# Altium project B100AA.PrjPcb (part 4 of 7)

## Sheet Master MicroController Port D.SchDoc: Master Micro Controller Port D Pin Out
size A4; ApprovedBy: Mehmet Günce Akkoyun; CheckedBy: Mehmet Günce Akkoyun; Author: Mehmet Günce Akkoyun; CompanyName: Ovoo Electronics; DrawnBy: Mehmet Günce Akkoyun; Engineer: Mehmet Günce Akkoyun; Organization: Ovoo Electronics; Address1: Necip Fazıl Mah. Ortaırmak Sok.; Address2: Birgül Apt. No: 19/6; Address3: Meram / Konya; Address4: Turkiye; DocumentNumber: 19; Revision: R06; SheetNumber: 19; SheetTotal: 54
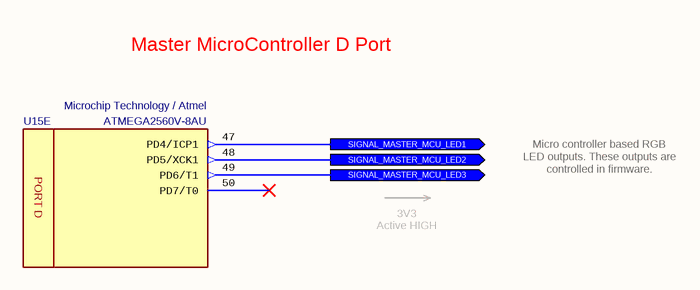
[diagram p31: Master MicroController Port D.SchDoc]

### Parts
U15  Manufacturer_Part_Number: ATMEGA2560V-8AU  Manufacturer_Name: Microchip Technology / Atmel  [TQFP100]  (hidden comment: 8-bit MicroController)  (part E of 15)

### Ports
SIGNAL_MASTER_MCU_LED1 (out), SIGNAL_MASTER_MCU_LED2 (out), SIGNAL_MASTER_MCU_LED3 (out)

### Nets
SIGNAL_MASTER_MCU_LED1: U15.47(PD4/ICP1) ; port SIGNAL_MASTER_MCU_LED1
SIGNAL_MASTER_MCU_LED2: U15.48(PD5/XCK1) ; port SIGNAL_MASTER_MCU_LED2
SIGNAL_MASTER_MCU_LED3: U15.49(PD6/T1) ; port SIGNAL_MASTER_MCU_LED3

Not connected (* = marked no-connect by the designer): U15 50(PD7/T0)*

### Notes on the sheet
- Master MicroController D Port
- 3V3
  Active HIGH
- Micro controller based RGB LED outputs. These outputs are controlled in firmware.
- Engineer
- All Rights are reserved to Customer and Engineer. [2021]
- Size:
- Date:
- A4
- Project :
- Time:
- Sheet
- of
- Customer
- Product ID
- Module ID
- Version
- File:
- Revision
- (in symbol IC - ATMEGA2560V-8AU, part E) PORT D

### Library data of the parts
U15 = IC - ATMEGA2560V-8AU: 8-bit Microcontrollers - MCU 256kB Flash 4kB EEPROM 86 I/O Pins; Supply Voltage - Min: 2V7; Supply Voltage - Max: 5.5V; Height: 1mm; Mouser_Part_Number: 556-ATMEGA2560V8AU; ComponentLink1Description: DataSheet; ComponentLink1URL: https://eu.mouser.com/datasheet/2/268/Atmel-2549-8-bit-AVR-Microcontroller-ATmega640-128-1315286.pdf; ROHS: Yes; Minimum Operating Temperature: -40; Maximum Operating Temperature: +85; ComponentLink2Description: Mouser; ComponentLink2URL: https://eu.mouser.com/ProductDetail/Microchip-Technology-Atmel/ATMEGA2560V-8AU?qs=sGAEpiMZZMutXGli8Ay4kKlCYcvZUWqJYdtgGFyqFT8%3D; Supplier 1: Mouser; Supplier 2: Arrow; Supplier 3: Farnell; Supplier 4: Newark; Supplier 5: Digi-Key; Supplier Part Number 1: 556-ATMEGA2560V8AU; Supplier Part Number 2: ATMEGA2560V-8AU; Supplier Part Number 3: 1288331; Supplier Part Number 4: 68T2784; Supplier Part Number 5: ATMEGA2560V-8AU-ND; Case: TQFP-100

## Sheet Master MicroController Serial Communication Port.SchDoc: Master MicroController Communication Port Pin Out
size A4; ApprovedBy: Mehmet Günce Akkoyun; CheckedBy: Mehmet Günce Akkoyun; Author: Mehmet Günce Akkoyun; CompanyName: Ovoo Electronics; DrawnBy: Mehmet Günce Akkoyun; Engineer: Mehmet Günce Akkoyun; Organization: Ovoo Electronics; Address1: Necip Fazıl Mah. Ortaırmak Sok.; Address2: Birgül Apt. No: 19/6; Address3: Meram / Konya; Address4: Turkiye; DocumentNumber: 27; Revision: R06; SheetNumber: 27; SheetTotal: 54
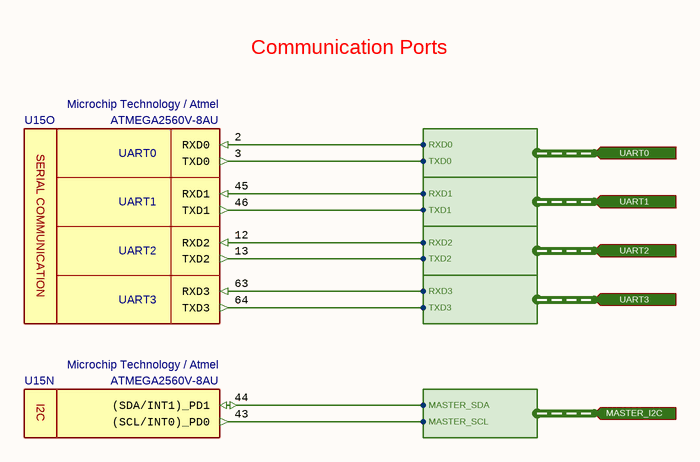
[diagram p32: Master MicroController Serial Communication Port.SchDoc]

### Parts
U15  Manufacturer_Part_Number: ATMEGA2560V-8AU  Manufacturer_Name: Microchip Technology / Atmel  [TQFP100]  (hidden comment: 8-bit MicroController)  (parts N,O of 15)

### Ports
MASTER_I2C (in, harness MASTER_I2C), UART0 (in, harness UART0), UART1 (in, harness UART1), UART2 (in, harness UART2), UART3 (in, harness UART3)

### Harnesses
UART0: RXD0, TXD0
UART1: RXD1, TXD1
UART2: RXD2, TXD2
UART3: RXD3, TXD3
MASTER_I2C: MASTER_SDA, MASTER_SCL

### Nets
GSM_3V3_UART.GSM_3V3_RX: U15.64(TXD3) ; port UART3.TXD3
GSM_3V3_UART.GSM_3V3_TX: U15.63(RXD3) ; port UART3.RXD3
MASTER_I2C.MASTER_SCL: U15.43((SCL/INT0)_PD0) ; port MASTER_I2C.MASTER_SCL
MASTER_I2C.MASTER_SDA: U15.44((SDA/INT1)_PD1) ; port MASTER_I2C.MASTER_SDA
UART0.RXD0: U15.2(RXD0) ; port UART0.RXD0
UART0.TXD0: U15.3(TXD0) ; port UART0.TXD0
UART1.RXD1: U15.45(RXD1) ; port UART1.RXD1
UART1.TXD1: U15.46(TXD1) ; port UART1.TXD1
UART2.RXD2: U15.12(RXD2) ; port UART2.RXD2
UART2.TXD2: U15.13(TXD2) ; port UART2.TXD2

### Notes on the sheet
- Communication Ports
- Engineer
- All Rights are reserved to Customer and Engineer. [2021]
- Size:
- Date:
- A4
- Project :
- Time:
- Sheet
- of
- Customer
- Product ID
- Module ID
- Version
- File:
- Revision
- (in symbol IC - ATMEGA2560V-8AU, part N) I2C
- (in symbol IC - ATMEGA2560V-8AU, part O) UART0; UART1; SERIAL COMMUNICATION; UART2; UART3

### Library data of the parts
U15 = IC - ATMEGA2560V-8AU: as U15 on sheet Master MicroController Port D; Height: 1mm; Mouser_Part_Number: 556-ATMEGA2560V8AU; ComponentLink1Description: DataSheet; ComponentLink1URL: https://eu.mouser.com/datasheet/2/268/Atmel-2549-8-bit-AVR-Microcontroller-ATmega640-128-1315286.pdf; ROHS: Yes; Minimum Operating Temperature: -40; Maximum Operating Temperature: +85; ComponentLink2Description: Mouser; ComponentLink2URL: https://eu.mouser.com/ProductDetail/Microchip-Technology-Atmel/ATMEGA2560V-8AU?qs=sGAEpiMZZMutXGli8Ay4kKlCYcvZUWqJYdtgGFyqFT8%3D; Supplier 1: Mouser; Supplier 2: Arrow; Supplier 3: Farnell; Supplier 4: Newark; Supplier 5: Digi-Key; Supplier Part Number 1: 556-ATMEGA2560V8AU; Supplier Part Number 2: ATMEGA2560V-8AU; Supplier Part Number 3: 1288331; Supplier Part Number 4: 68T2784; Supplier Part Number 5: ATMEGA2560V-8AU-ND; Case: TQFP-100

## Sheet Module Output Sockets.SchDoc: Module Output Sockets
size A2; ApprovedBy: Mehmet Günce Akkoyun; CheckedBy: Mehmet Günce Akkoyun; Author: Mehmet Günce Akkoyun; CompanyName: Ovoo Electronics; DrawnBy: Mehmet Günce Akkoyun; Engineer: Mehmet Günce Akkoyun; Organization: Ovoo Electronics; Address1: Necip Fazıl Mah. Ortaırmak Sok.; Address2: Birgül Apt. No: 19/6; Address3: Meram / Konya; Address4: Turkiye; DocumentNumber: 29; Revision: R06; SheetNumber: 29; SheetTotal: 54
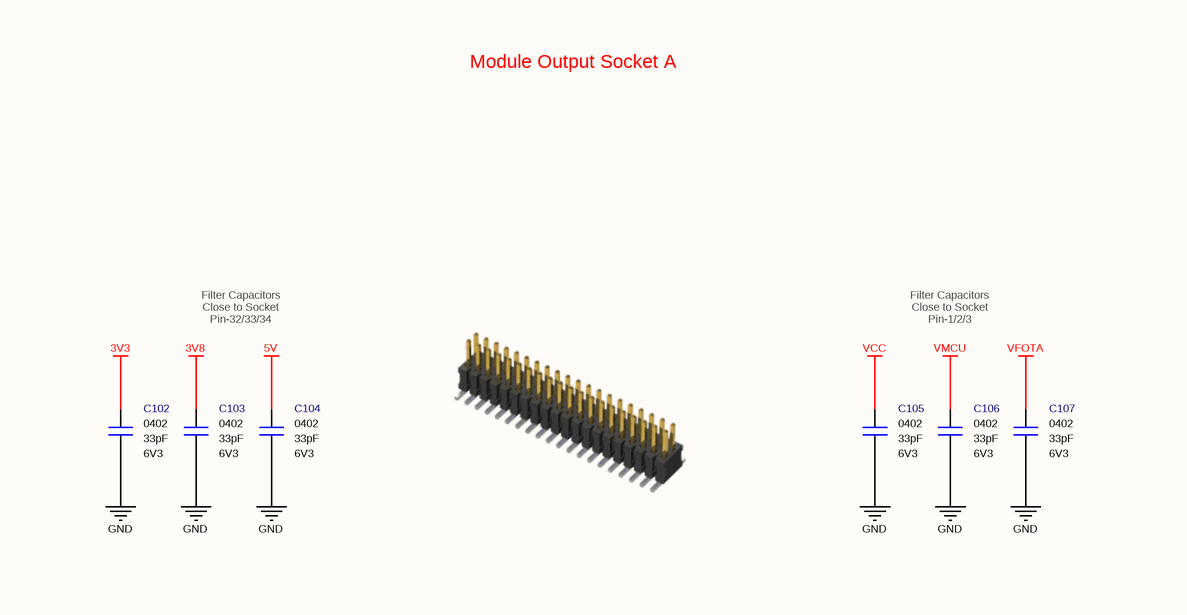
[diagram p33: Module Output Sockets.SchDoc, top left]
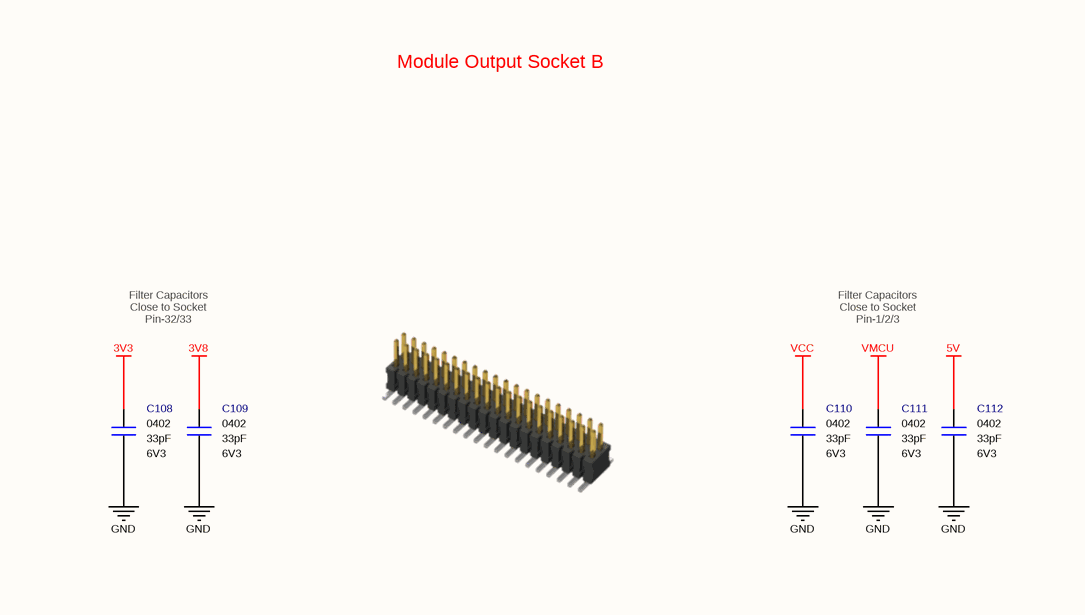
[diagram p34: Module Output Sockets.SchDoc, top right]
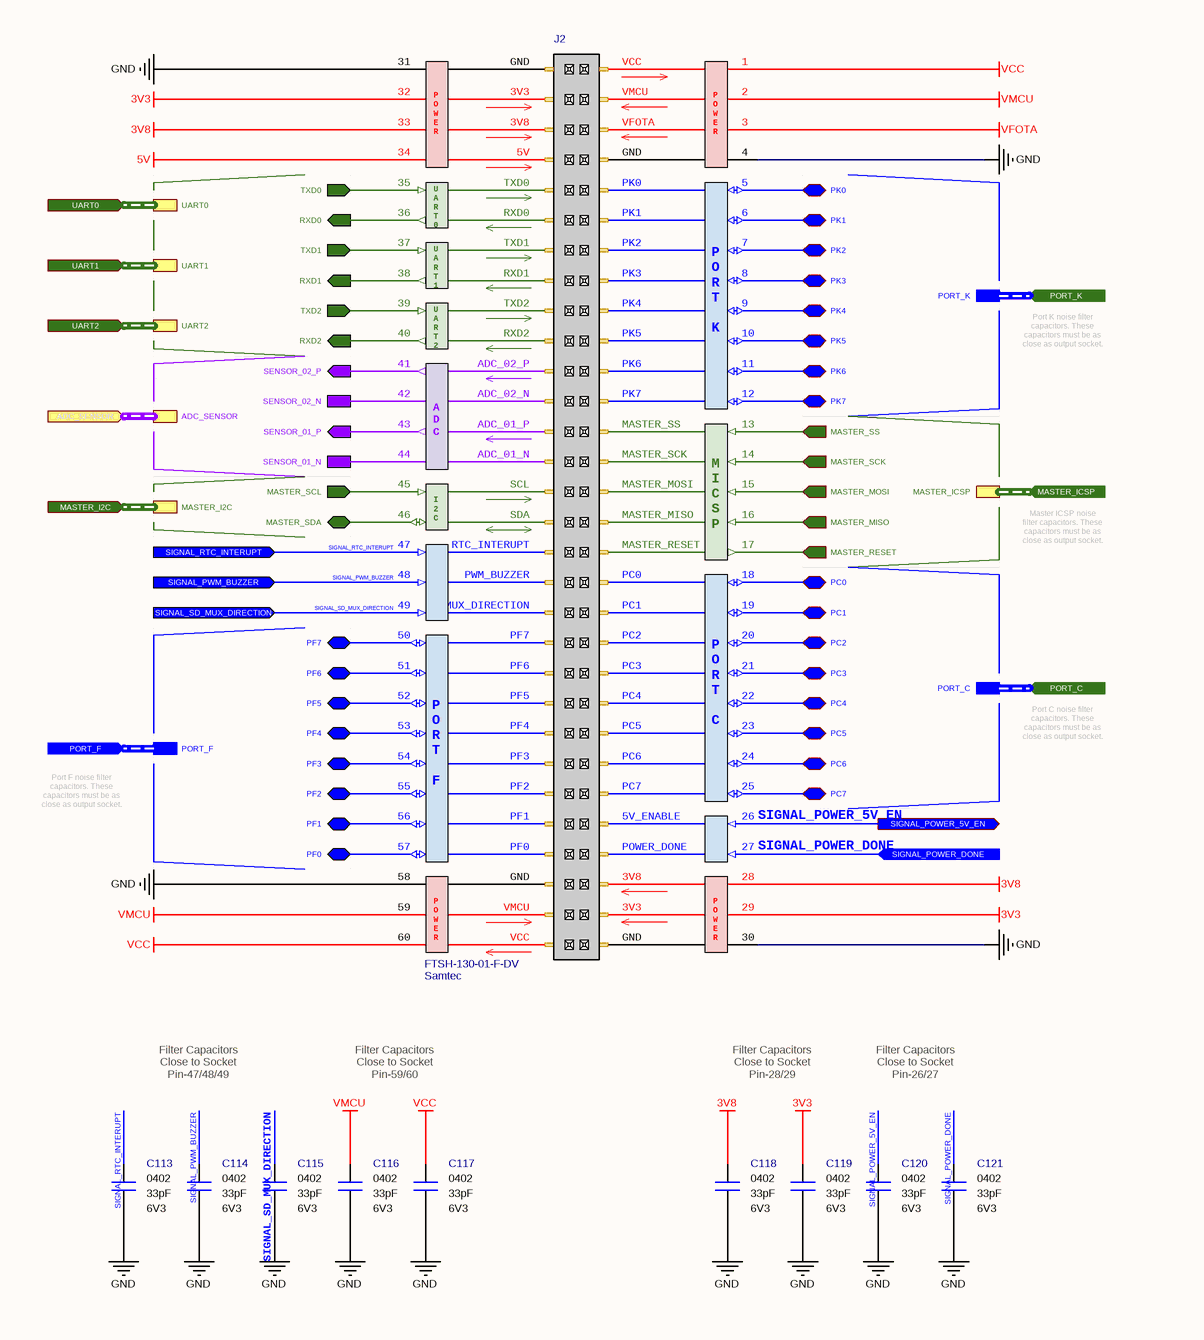
[diagram p35: Module Output Sockets.SchDoc, bottom left]
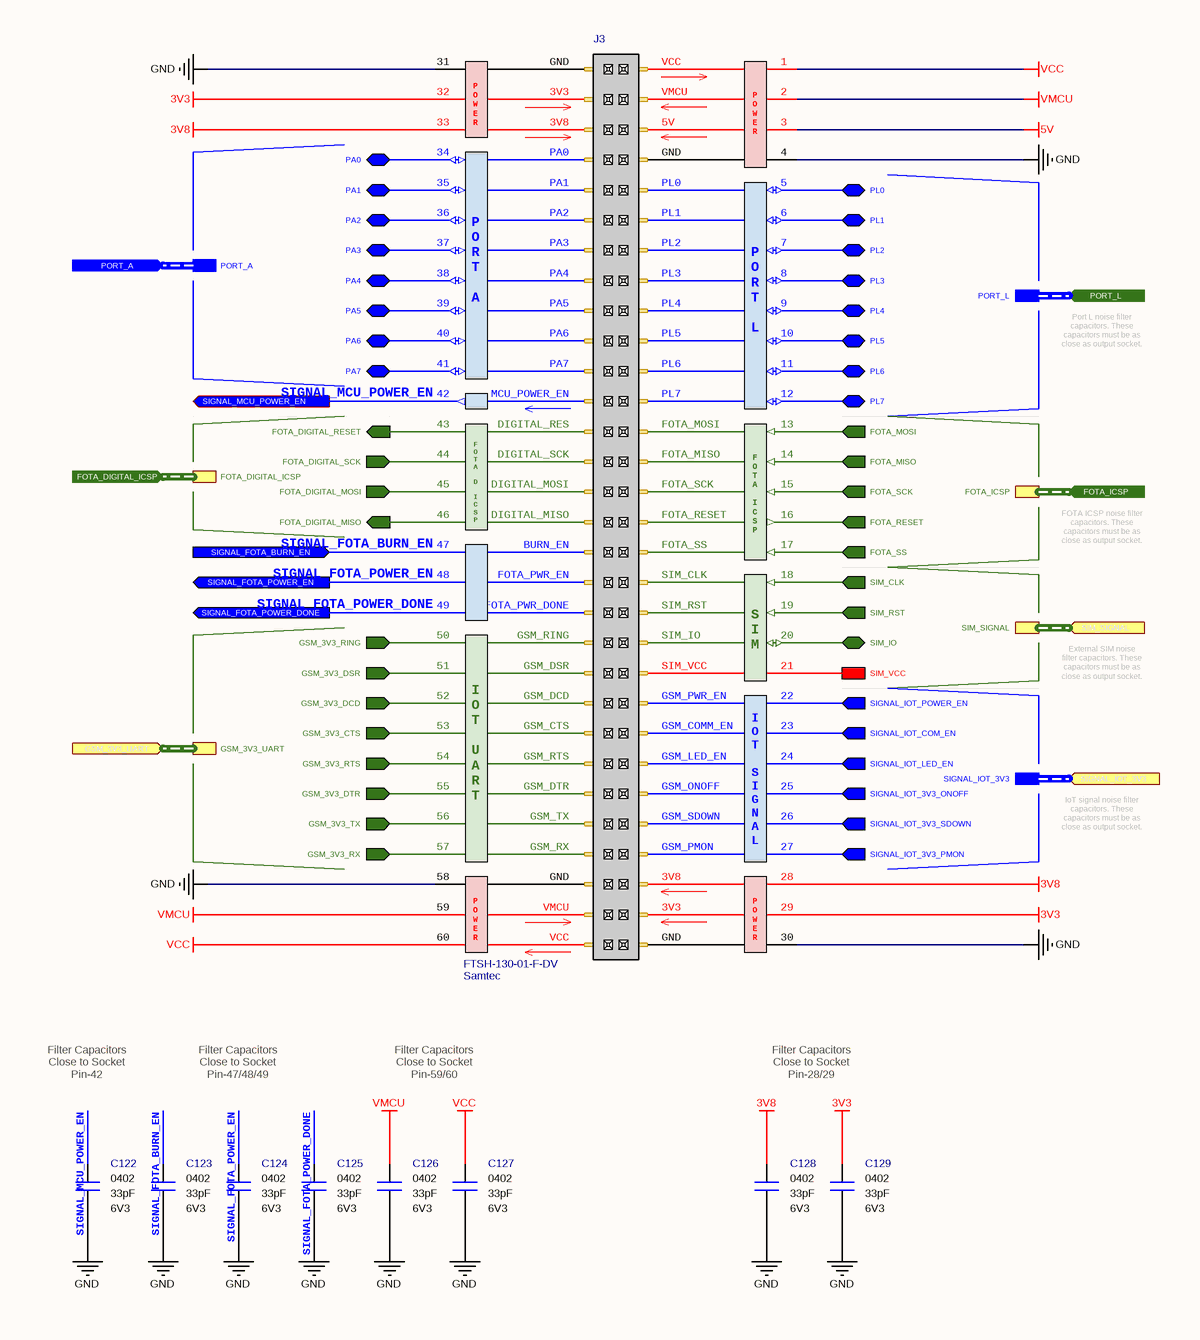
[diagram p36: Module Output Sockets.SchDoc, bottom right]

### Parts
C102  value 33pF  Case: 0402  Voltage: 6V3  [CAPACITOR_0402]  (hidden comment: Multilayer Ceramic Capacitor)
C103  value 33pF  Case: 0402  Voltage: 6V3  [CAPACITOR_0402]  (hidden comment: Multilayer Ceramic Capacitor)
C104  value 33pF  Case: 0402  Voltage: 6V3  [CAPACITOR_0402]  (hidden comment: Multilayer Ceramic Capacitor)
C105  value 33pF  Case: 0402  Voltage: 6V3  [CAPACITOR_0402]  (hidden comment: Multilayer Ceramic Capacitor)
C106  value 33pF  Case: 0402  Voltage: 6V3  [CAPACITOR_0402]  (hidden comment: Multilayer Ceramic Capacitor)
C107  value 33pF  Case: 0402  Voltage: 6V3  [CAPACITOR_0402]  (hidden comment: Multilayer Ceramic Capacitor)
C108  value 33pF  Case: 0402  Voltage: 6V3  [CAPACITOR_0402]  (hidden comment: Multilayer Ceramic Capacitor)
C109  value 33pF  Case: 0402  Voltage: 6V3  [CAPACITOR_0402]  (hidden comment: Multilayer Ceramic Capacitor)
C110  value 33pF  Case: 0402  Voltage: 6V3  [CAPACITOR_0402]  (hidden comment: Multilayer Ceramic Capacitor)
C111  value 33pF  Case: 0402  Voltage: 6V3  [CAPACITOR_0402]  (hidden comment: Multilayer Ceramic Capacitor)
C112  value 33pF  Case: 0402  Voltage: 6V3  [CAPACITOR_0402]  (hidden comment: Multilayer Ceramic Capacitor)
C113  value 33pF  Case: 0402  Voltage: 6V3  [CAPACITOR_0402]  (hidden comment: Multilayer Ceramic Capacitor)
C114  value 33pF  Case: 0402  Voltage: 6V3  [CAPACITOR_0402]  (hidden comment: Multilayer Ceramic Capacitor)
C115  value 33pF  Case: 0402  Voltage: 6V3  [CAPACITOR_0402]  (hidden comment: Multilayer Ceramic Capacitor)
C116  value 33pF  Case: 0402  Voltage: 6V3  [CAPACITOR_0402]  (hidden comment: Multilayer Ceramic Capacitor)
C117  value 33pF  Case: 0402  Voltage: 6V3  [CAPACITOR_0402]  (hidden comment: Multilayer Ceramic Capacitor)
C118  value 33pF  Case: 0402  Voltage: 6V3  [CAPACITOR_0402]  (hidden comment: Multilayer Ceramic Capacitor)
C119  value 33pF  Case: 0402  Voltage: 6V3  [CAPACITOR_0402]  (hidden comment: Multilayer Ceramic Capacitor)
C120  value 33pF  Case: 0402  Voltage: 6V3  [CAPACITOR_0402]  (hidden comment: Multilayer Ceramic Capacitor)
C121  value 33pF  Case: 0402  Voltage: 6V3  [CAPACITOR_0402]  (hidden comment: Multilayer Ceramic Capacitor)
C122  value 33pF  Case: 0402  Voltage: 6V3  [CAPACITOR_0402]  (hidden comment: Multilayer Ceramic Capacitor)
C123  value 33pF  Case: 0402  Voltage: 6V3  [CAPACITOR_0402]  (hidden comment: Multilayer Ceramic Capacitor)
C124  value 33pF  Case: 0402  Voltage: 6V3  [CAPACITOR_0402]  (hidden comment: Multilayer Ceramic Capacitor)
C125  value 33pF  Case: 0402  Voltage: 6V3  [CAPACITOR_0402]  (hidden comment: Multilayer Ceramic Capacitor)
C126  value 33pF  Case: 0402  Voltage: 6V3  [CAPACITOR_0402]  (hidden comment: Multilayer Ceramic Capacitor)
C127  value 33pF  Case: 0402  Voltage: 6V3  [CAPACITOR_0402]  (hidden comment: Multilayer Ceramic Capacitor)
C128  value 33pF  Case: 0402  Voltage: 6V3  [CAPACITOR_0402]  (hidden comment: Multilayer Ceramic Capacitor)
C129  value 33pF  Case: 0402  Voltage: 6V3  [CAPACITOR_0402]  (hidden comment: Multilayer Ceramic Capacitor)
J2  Manufacturer Part Number: FTSH-130-01-F-DV  Manufacturer Name: Samtec  [SAMTEC-FTSH-130-01-X-DV]  (hidden comment: 1.27 mm Pitch 2x30P Male Connector)
J3  Manufacturer Part Number: FTSH-130-01-F-DV  Manufacturer Name: Samtec  [SAMTEC-FTSH-130-01-X-DV]  (hidden comment: 1.27 mm Pitch 2x30P Male Connector)

### Sub-sheets
ADC Sensor Filter Capacitors = Filter Capacitors - ADC Sensor.SchDoc: ADC_SENSOR (harness ADC_SENSOR), SENSOR_01_N, SENSOR_01_P (in), SENSOR_02_N, SENSOR_02_P (in)
FOTA Digital ICSP Filter Capacitors = Filter Capacitors - FOTA Digital ICSP.SchDoc: FOTA_DIGITAL_ICSP (harness FOTA_DIGITAL_ICSP), FOTA_DIGITAL_MISO (in), FOTA_DIGITAL_MOSI (out), FOTA_DIGITAL_SCK (out), FOTA_DIGITAL_RESET (in)
FOTA ICSP Filter Capacitors = Filter Capacitors - FOTA ICSP.SchDoc: FOTA_ICSP (harness FOTA_ICSP), FOTA_MOSI (out), FOTA_SS (out), FOTA_MISO (out), FOTA_SCK (out), FOTA_RESET (out)
I2C Filter Capacitors = Filter Capacitors - I2C.SchDoc: MASTER_I2C (harness MASTER_I2C), MASTER_SDA (bidir), MASTER_SCL (out)
IoT UART Filter Capacitors = Filter Capacitors - IoT UART.SchDoc: GSM_3V3_UART (harness GSM_3V3_UART), GSM_3V3_RTS (out), GSM_3V3_RING (out), GSM_3V3_CTS (out), GSM_3V3_DTR (out), GSM_3V3_DCD (out), GSM_3V3_RX (out), GSM_3V3_DSR (out), GSM_3V3_TX (out)
Master ICSP Filter Capacitors = Filter Capacitors - Master ICSP.SchDoc: MASTER_ICSP (harness MASTER_ICSP), MASTER_SS (out), MASTER_RESET (out), MASTER_SCK (out), MASTER_MOSI (out), MASTER_MISO (out)
PORT A Filter Capacitors = Filter Capacitors - Port A.SchDoc: PA4 (bidir), PA2 (bidir), PA0 (bidir), PA5 (bidir), PA3 (bidir), PA1 (bidir), PA7 (bidir), PA6 (bidir), PORT_A (harness PORT_A)
PORT C Filter Capacitors = Filter Capacitors - Port C.SchDoc: PC4 (bidir), PC2 (bidir), PC0 (bidir), PC5 (bidir), PC3 (bidir), PC1 (bidir), PC7 (bidir), PC6 (bidir), PORT_C (harness PORT_C)
PORT F Filter Capacitors = Filter Capacitors - Port F.SchDoc: PF4 (bidir), PF2 (bidir), PF0 (bidir), PF5 (bidir), PF3 (bidir), PF1 (bidir), PF7 (bidir), PF6 (bidir), PORT_F (harness PORT_F)
PORT K Filter Capacitors = Filter Capacitors - Port K.SchDoc: PK4 (bidir), PK2 (bidir), PK0 (bidir), PK5 (bidir), PK3 (bidir), PK1 (bidir), PK7 (bidir), PK6 (bidir), PORT_K (harness PORT_K)
PORT L Filter Capacitors = Filter Capacitors - Port L.SchDoc: PL4 (bidir), PL2 (bidir), PL0 (bidir), PL5 (bidir), PL3 (bidir), PL1 (bidir), PL7 (bidir), PL6 (bidir), PORT_L (harness PORT_L)
Serial Communication Filter Capacitors = Filter Capacitors - Serial Communication.SchDoc: UART0 (harness UART0), TXD2 (out), UART2 (harness UART2), TXD1 (out), RXD1 (in), RXD0 (in), TXD0 (out), UART1 (harness UART1), RXD2 (in)
Signal IoT Filter Capacitors = Filter Capacitors - Signal IoT.SchDoc: SIGNAL_IOT_3V3_SDOWN (out), SIGNAL_IOT_LED_EN (out), SIGNAL_IOT_POWER_EN (out), SIGNAL_IOT_3V3_PMON (out), SIGNAL_IOT_3V3_ONOFF (out), SIGNAL_IOT_COM_EN (out), SIGNAL_IOT_3V3 (harness SIGNAL_IOT_3V3)
SIM Signal Filter Capacitors = Filter Capacitors - External SIM.SchDoc: SIM_SIGNAL (harness SIM_SIGNAL), SIM_CLK (out), SIM_RST (out), SIM_IO (bidir), SIM_VCC

### Ports
ADC_SENSOR (in, harness ADC_SENSOR), FOTA_DIGITAL_ICSP (in, harness FOTA_DIGITAL_ICSP), FOTA_ICSP (in, harness FOTA_ICSP), GSM_3V3_UART (in, harness GSM_3V3_UART), MASTER_I2C (in, harness MASTER_I2C), MASTER_ICSP (in, harness MASTER_ICSP), PORT_A (in, harness PORT_A), PORT_C (in, harness PORT_C), PORT_F (in, harness PORT_F), PORT_K (in, harness PORT_K), PORT_L (in, harness PORT_L), SIGNAL_FOTA_BURN_EN (in), SIGNAL_FOTA_POWER_DONE (out), SIGNAL_FOTA_POWER_EN (out), SIGNAL_IOT_3V3 (in, harness SIGNAL_IOT_3V3), SIGNAL_MCU_POWER_EN (out), SIGNAL_POWER_5V_EN (out), SIGNAL_POWER_DONE (in), SIGNAL_PWM_BUZZER (in), SIGNAL_RTC_INTERUPT (in), SIGNAL_SD_MUX_DIRECTION (in), SIM_SIGNAL (in, harness SIM_SIGNAL), UART0 (in, harness UART0), UART1 (in, harness UART1), UART2 (in, harness UART2)

### Nets
3V3: C102.2 C108.2 C119.2 C129.2 J2.29(Pin-29) J2.32(Pin-32) J3.29(Pin-29) J3.32(Pin-32)
3V8: C103.2 C109.2 C118.2 C128.2 J2.28(Pin-28) J2.33(Pin-33) J3.28(Pin-28) J3.33(Pin-33)
5V: C104.2 C112.2 J2.34(Pin-34) J3.3(Pin-3)
GND: C102.1 C103.1 C104.1 C105.1 C106.1 C107.1 C108.1 C109.1 C110.1 C111.1 C112.1 C113.1 C114.1 C115.1 C116.1 C117.1 C118.1 C119.1 C120.1 C121.1 C122.1 C123.1 C124.1 C125.1 C126.1 C127.1 C128.1 C129.1 J2.4(Pin-4) J2.30(Pin-30) J2.31(Pin-31) J2.58(Pin-58) J3.4(Pin-4) J3.30(Pin-30) J3.31(Pin-31) J3.58(Pin-58)
VCC: C105.2 C110.2 C117.2 C127.2 J2.1(Pin-1) J2.60(Pin-60) J3.1(Pin-1) J3.60(Pin-60)
VFOTA: C107.2 J2.3(Pin-3)
VMCU: C106.2 C111.2 C116.2 C126.2 J2.2(Pin-2) J2.59(Pin-59) J3.2(Pin-2) J3.59(Pin-59)
FOTA_DIGITAL_ICSP.FOTA_DIGITAL_MISO: J3.46(Pin-46) ; sheet FOTA Digital ICSP Filter Capacitors/FOTA_DIGITAL_MISO
FOTA_DIGITAL_ICSP.FOTA_DIGITAL_MOSI: J3.45(Pin-45) ; sheet FOTA Digital ICSP Filter Capacitors/FOTA_DIGITAL_MOSI
FOTA_DIGITAL_ICSP.FOTA_DIGITAL_RESET: J3.43(Pin-43) ; sheet FOTA Digital ICSP Filter Capacitors/FOTA_DIGITAL_RESET
FOTA_DIGITAL_ICSP.FOTA_DIGITAL_SCK: J3.44(Pin-44) ; sheet FOTA Digital ICSP Filter Capacitors/FOTA_DIGITAL_SCK
FOTA_ICSP.FOTA_MISO: J3.14(Pin-14) ; sheet FOTA ICSP Filter Capacitors/FOTA_MISO
FOTA_ICSP.FOTA_MOSI: J3.13(Pin-13) ; sheet FOTA ICSP Filter Capacitors/FOTA_MOSI
FOTA_ICSP.FOTA_RESET: J3.16(Pin-16) ; sheet FOTA ICSP Filter Capacitors/FOTA_RESET
FOTA_ICSP.FOTA_SCK: J3.15(Pin-15) ; sheet FOTA ICSP Filter Capacitors/FOTA_SCK
FOTA_ICSP.FOTA_SS: J3.17(Pin-17) ; sheet FOTA ICSP Filter Capacitors/FOTA_SS
GSM_3V3_UART.GSM_3V3_CTS: J3.53(Pin-53) ; sheet IoT UART Filter Capacitors/GSM_3V3_CTS
GSM_3V3_UART.GSM_3V3_DCD: J3.52(Pin-52) ; sheet IoT UART Filter Capacitors/GSM_3V3_DCD
GSM_3V3_UART.GSM_3V3_DSR: J3.51(Pin-51) ; sheet IoT UART Filter Capacitors/GSM_3V3_DSR
GSM_3V3_UART.GSM_3V3_DTR: J3.55(Pin-55) ; sheet IoT UART Filter Capacitors/GSM_3V3_DTR
GSM_3V3_UART.GSM_3V3_RING: J3.50(Pin-50) ; sheet IoT UART Filter Capacitors/GSM_3V3_RING
GSM_3V3_UART.GSM_3V3_RTS: J3.54(Pin-54) ; sheet IoT UART Filter Capacitors/GSM_3V3_RTS
GSM_3V3_UART.GSM_3V3_RX: J3.57(Pin-57) ; sheet IoT UART Filter Capacitors/GSM_3V3_RX
GSM_3V3_UART.GSM_3V3_TX: J3.56(Pin-56) ; sheet IoT UART Filter Capacitors/GSM_3V3_TX
MASTER_I2C.MASTER_SCL: J2.45(Pin-45) ; sheet I2C Filter Capacitors/MASTER_SCL
MASTER_I2C.MASTER_SDA: J2.46(Pin-46) ; sheet I2C Filter Capacitors/MASTER_SDA
MASTER_ICSP.MASTER_MISO: J2.16(Pin-16) ; sheet Master ICSP Filter Capacitors/MASTER_MISO
MASTER_ICSP.MASTER_MOSI: J2.15(Pin-15) ; sheet Master ICSP Filter Capacitors/MASTER_MOSI
MASTER_ICSP.MASTER_RESET: J2.17(Pin-17) ; sheet Master ICSP Filter Capacitors/MASTER_RESET
MASTER_ICSP.MASTER_SCK: J2.14(Pin-14) ; sheet Master ICSP Filter Capacitors/MASTER_SCK
MASTER_ICSP.MASTER_SS: J2.13(Pin-13) ; sheet Master ICSP Filter Capacitors/MASTER_SS
PORT_A.PA0: J3.34(Pin-34) ; sheet PORT A Filter Capacitors/PA0
PORT_A.PA1: J3.35(Pin-35) ; sheet PORT A Filter Capacitors/PA1
PORT_A.PA2: J3.36(Pin-36) ; sheet PORT A Filter Capacitors/PA2
PORT_A.PA3: J3.37(Pin-37) ; sheet PORT A Filter Capacitors/PA3
PORT_A.PA4: J3.38(Pin-38) ; sheet PORT A Filter Capacitors/PA4
PORT_A.PA5: J3.39(Pin-39) ; sheet PORT A Filter Capacitors/PA5
PORT_A.PA6: J3.40(Pin-40) ; sheet PORT A Filter Capacitors/PA6
PORT_A.PA7: J3.41(Pin-41) ; sheet PORT A Filter Capacitors/PA7
PORT_C.PC0: J2.18(Pin-18) ; sheet PORT C Filter Capacitors/PC0
PORT_C.PC1: J2.19(Pin-19) ; sheet PORT C Filter Capacitors/PC1
PORT_C.PC2: J2.20(Pin-20) ; sheet PORT C Filter Capacitors/PC2
PORT_C.PC3: J2.21(Pin-21) ; sheet PORT C Filter Capacitors/PC3
PORT_C.PC4: J2.22(Pin-22) ; sheet PORT C Filter Capacitors/PC4
PORT_C.PC5: J2.23(Pin-23) ; sheet PORT C Filter Capacitors/PC5
PORT_C.PC6: J2.24(Pin-24) ; sheet PORT C Filter Capacitors/PC6
PORT_C.PC7: J2.25(Pin-25) ; sheet PORT C Filter Capacitors/PC7
PORT_F.PF0: J2.57(Pin-57) ; sheet PORT F Filter Capacitors/PF0
PORT_F.PF1: J2.56(Pin-56) ; sheet PORT F Filter Capacitors/PF1
PORT_F.PF2: J2.55(Pin-55) ; sheet PORT F Filter Capacitors/PF2
PORT_F.PF3: J2.54(Pin-54) ; sheet PORT F Filter Capacitors/PF3
PORT_F.PF4: J2.53(Pin-53) ; sheet PORT F Filter Capacitors/PF4
PORT_F.PF5: J2.52(Pin-52) ; sheet PORT F Filter Capacitors/PF5
PORT_F.PF6: J2.51(Pin-51) ; sheet PORT F Filter Capacitors/PF6
PORT_F.PF7: J2.50(Pin-50) ; sheet PORT F Filter Capacitors/PF7
PORT_K.PK0: J2.5(Pin-5) ; sheet PORT K Filter Capacitors/PK0
PORT_K.PK1: J2.6(Pin-6) ; sheet PORT K Filter Capacitors/PK1
PORT_K.PK2: J2.7(Pin-7) ; sheet PORT K Filter Capacitors/PK2
PORT_K.PK3: J2.8(Pin-8) ; sheet PORT K Filter Capacitors/PK3
PORT_K.PK4: J2.9(Pin-9) ; sheet PORT K Filter Capacitors/PK4
PORT_K.PK5: J2.10(Pin-10) ; sheet PORT K Filter Capacitors/PK5
PORT_K.PK6: J2.11(Pin-11) ; sheet PORT K Filter Capacitors/PK6
PORT_K.PK7: J2.12(Pin-12) ; sheet PORT K Filter Capacitors/PK7
PORT_L.PL0: J3.5(Pin-5) ; sheet PORT L Filter Capacitors/PL0
PORT_L.PL1: J3.6(Pin-6) ; sheet PORT L Filter Capacitors/PL1
PORT_L.PL2: J3.7(Pin-7) ; sheet PORT L Filter Capacitors/PL2
PORT_L.PL3: J3.8(Pin-8) ; sheet PORT L Filter Capacitors/PL3
PORT_L.PL4: J3.9(Pin-9) ; sheet PORT L Filter Capacitors/PL4
PORT_L.PL5: J3.10(Pin-10) ; sheet PORT L Filter Capacitors/PL5
PORT_L.PL6: J3.11(Pin-11) ; sheet PORT L Filter Capacitors/PL6
PORT_L.PL7: J3.12(Pin-12) ; sheet PORT L Filter Capacitors/PL7
SIGNAL_FOTA_BURN_EN: C123.2 J3.47(Pin-47) ; port SIGNAL_FOTA_BURN_EN
SIGNAL_FOTA_POWER_DONE: C125.2 J3.49(Pin-49) ; port SIGNAL_FOTA_POWER_DONE
SIGNAL_FOTA_POWER_EN: C124.2 J3.48(Pin-48) ; port SIGNAL_FOTA_POWER_EN
SIGNAL_IOT_3V3.SIGNAL_IOT_3V3_ONOFF: J3.25(Pin-25) ; sheet Signal IoT Filter Capacitors/SIGNAL_IOT_3V3_ONOFF
SIGNAL_IOT_3V3.SIGNAL_IOT_3V3_PMON: J3.27(Pin-27) ; sheet Signal IoT Filter Capacitors/SIGNAL_IOT_3V3_PMON
SIGNAL_IOT_3V3.SIGNAL_IOT_3V3_SDOWN: J3.26(Pin-26) ; sheet Signal IoT Filter Capacitors/SIGNAL_IOT_3V3_SDOWN
SIGNAL_IOT_3V3.SIGNAL_IOT_COM_EN: J3.23(Pin-23) ; sheet Signal IoT Filter Capacitors/SIGNAL_IOT_COM_EN
SIGNAL_IOT_3V3.SIGNAL_IOT_LED_EN: J3.24(Pin-24) ; sheet Signal IoT Filter Capacitors/SIGNAL_IOT_LED_EN
SIGNAL_IOT_3V3.SIGNAL_IOT_POWER_EN: J3.22(Pin-22) ; sheet Signal IoT Filter Capacitors/SIGNAL_IOT_POWER_EN
SIGNAL_MCU_POWER_EN: C122.2 J3.42(Pin-42) ; port SIGNAL_MCU_POWER_EN
SIGNAL_POWER_5V_EN: C120.2 J2.26(Pin-26) ; port SIGNAL_POWER_5V_EN
SIGNAL_POWER_DONE: C121.2 J2.27(Pin-27) ; port SIGNAL_POWER_DONE
SIGNAL_PWM_BUZZER: C114.2 J2.48(Pin-48) ; port SIGNAL_PWM_BUZZER
SIGNAL_RTC_INTERUPT: C113.2 J2.47(Pin-47) ; port SIGNAL_RTC_INTERUPT
SIGNAL_SD_MUX_DIRECTION: C115.2 J2.49(Pin-49) ; port SIGNAL_SD_MUX_DIRECTION
SIM_CLK: J3.18(Pin-18) ; sheet SIM Signal Filter Capacitors/SIM_CLK
SIM_IO: J3.20(Pin-20) ; sheet SIM Signal Filter Capacitors/SIM_IO
SIM_RST: J3.19(Pin-19) ; sheet SIM Signal Filter Capacitors/SIM_RST
SIM_VCC: J3.21(Pin-21) ; sheet SIM Signal Filter Capacitors/SIM_VCC
UART0.RXD0: J2.36(Pin-36) ; sheet Serial Communication Filter Capacitors/RXD0
UART0.TXD0: J2.35(Pin-35) ; sheet Serial Communication Filter Capacitors/TXD0
UART1.RXD1: J2.38(Pin-38) ; sheet Serial Communication Filter Capacitors/RXD1
UART1.TXD1: J2.37(Pin-37) ; sheet Serial Communication Filter Capacitors/TXD1
UART2.RXD2: J2.40(Pin-40) ; sheet Serial Communication Filter Capacitors/RXD2
UART2.TXD2: J2.39(Pin-39) ; sheet Serial Communication Filter Capacitors/TXD2
NetC216_2: J2.42(Pin-42) ; sheet ADC Sensor Filter Capacitors/SENSOR_02_N
NetC217_2: J2.41(Pin-41) ; sheet ADC Sensor Filter Capacitors/SENSOR_02_P
NetC218_2: J2.44(Pin-44) ; sheet ADC Sensor Filter Capacitors/SENSOR_01_N
NetC219_2: J2.43(Pin-43) ; sheet ADC Sensor Filter Capacitors/SENSOR_01_P

### Buses and harness runs
harness port ADC_SENSOR = sheet ADC Sensor Filter Capacitors/ADC_SENSOR
harness port FOTA_DIGITAL_ICSP = sheet FOTA Digital ICSP Filter Capacitors/FOTA_DIGITAL_ICSP
harness port FOTA_ICSP = sheet FOTA ICSP Filter Capacitors/FOTA_ICSP
harness port GSM_3V3_UART = sheet IoT UART Filter Capacitors/GSM_3V3_UART
harness port MASTER_I2C = sheet I2C Filter Capacitors/MASTER_I2C
harness port MASTER_ICSP = sheet Master ICSP Filter Capacitors/MASTER_ICSP
harness port PORT_A = sheet PORT A Filter Capacitors/PORT_A
harness port PORT_C = sheet PORT C Filter Capacitors/PORT_C
harness port PORT_F = sheet PORT F Filter Capacitors/PORT_F
harness port PORT_K = sheet PORT K Filter Capacitors/PORT_K
harness port PORT_L = sheet PORT L Filter Capacitors/PORT_L
harness port SIGNAL_IOT_3V3 = sheet Signal IoT Filter Capacitors/SIGNAL_IOT_3V3
harness port SIM_SIGNAL = sheet SIM Signal Filter Capacitors/SIM_SIGNAL
harness port UART0 = sheet Serial Communication Filter Capacitors/UART0
harness port UART1 = sheet Serial Communication Filter Capacitors/UART1
harness port UART2 = sheet Serial Communication Filter Capacitors/UART2

### Notes on the sheet
- Module Output Socket A
- Module Output Socket B
- Filter Capacitors
  Close to Socket
  Pin-32/33/34
- Filter Capacitors
  Close to Socket
  Pin-1/2/3
- Filter Capacitors
  Close to Socket
  Pin-32/33
- Port K noise filter capacitors. These capacitors must be as close as output socket.
- Port L noise filter capacitors. These capacitors must be as close as output socket.
- Master ICSP noise filter capacitors. These capacitors must be as close as output socket.
- FOTA ICSP noise filter capacitors. These capacitors must be as close as output socket.
- External SIM noise filter capacitors. These capacitors must be as close as output socket.
- Port C noise filter capacitors. These capacitors must be as close as output socket.
- Port F noise filter capacitors. These capacitors must be as close as output socket.
- IoT signal noise filter capacitors. These capacitors must be as close as output socket.
- Filter Capacitors
  Close to Socket
  Pin-47/48/49
- Filter Capacitors
  Close to Socket
  Pin-59/60
- Filter Capacitors
  Close to Socket
  Pin-28/29
- Filter Capacitors
  Close to Socket
  Pin-26/27
- Filter Capacitors
  Close to Socket
  Pin-42
- Title
- Size:
- Date:
- File:
- A2
- Number:
- Time:
- Revision:
- Sheet
- of
- (in symbol Connector - B100 Male Socket [A]) GND; VCC; 3V3; VMCU; 3V8; VFOTA; 5V; / P / O / W / E / R; TXD0; PK0; RXD0; PK1; U / A / R / T / 0; TXD1; PK2; RXD1; PK3; U / A / R / T / 1; TXD2; PK4; RXD2; PK5; U / A / R / T / 2; ADC_02_P; PK6; ADC_02_N; PK7; / P / O / R / T / K; ADC_01_P; MASTER_SS; ADC_01_N; MASTER_SCK; / A / D / C; SCL; MASTER_MOSI; SDA; MASTER_MISO; / I / 2 / C; RTC_INTERUPT; MASTER_RESET; / M / I / C / S / P; PWM_BUZZER; PC0; MUX_DIRECTION; PC1; PF7; PC2; PF6; PC3; PF5; PC4; PF4; PC5; PF3; PC6; PF2; PC7; / P / O / R / T / C; PF1; 5V_ENABLE; PF0; POWER_DONE; / P / O / R / T / F
- (in symbol Connector - B100 Male Socket [B]) GND; VCC; 3V3; VMCU; 3V8; 5V; / P / O / W / E / R; PA0; PA1; PL0; PA2; PL1; PA3; PL2; PA4; PL3; PA5; PL4; PA6; PL5; PA7; PL6; / P / O / R / T / A; MCU_POWER_EN; PL7; / P / O / R / T / L; DIGITAL_RES; FOTA_MOSI; DIGITAL_SCK; FOTA_MISO; DIGITAL_MOSI; FOTA_SCK; DIGITAL_MISO; FOTA_RESET; / F / O / T / A / D / I / C / S / P; BURN_EN; FOTA_SS; / F / O / T / A / I / C / S / P; FOTA_PWR_EN; SIM_CLK; FOTA_PWR_DONE; SIM_RST; GSM_RING; SIM_IO; GSM_DSR; SIM_VCC; / S / I / M; GSM_DCD; GSM_PWR_EN; GSM_CTS; GSM_COMM_EN; GSM_RTS; GSM_LED_EN; GSM_DTR; GSM_ONOFF; GSM_TX; GSM_SDOWN; GSM_RX; GSM_PMON; / I / O / T / U / A / R / T; / I / O / T / S / I / G / N / A / L

### Library data of the parts
C102-C129 = Capacitor - 33pF [0402-6V3]: Capacitor - 33pF [0402] (Ceramic); Manufacturer Name: Kemet; Manufacturer Part Number: C0402C330J9RACAUTO; Dielectric: X7R; Tolerance: 10%; Height: 0.5mm; Maximum Operating Temperature: +125; Minimum Operating Temperature: -55; ROHS: Yes; ComponentLink1Description: DataSheet; ComponentLink1URL: https://api.kemet.com/component-edge/download/datasheet/C0402C330J9RACAUTO.pdf; ComponentLink2Description: Mouser; ComponentLink2URL: https://www.mouser.com/Search/Refine.aspx?Keyword=80-C0402C330J9RAUTO; Supplier 1: Mouser; Supplier Part Number 1: 80-C0402C330J9RAUTO; Mouser Part Number: 80-C0402C330J9RAUTO
J2 = Connector - B100 Male Socket [A]: Headers & Wire Housings BREAKAWAY HDR VERT 6; Position: 60; Row: 2; Pitch: 1.27 mm; Mouser Part Number: 200-FTSH13001FDV; ROHS: Yes; ComponentLink1Description: DataSheet; ComponentLink1URL: https://www.mouser.com.tr/datasheet/2/527/ftsh_smt-1316912.pdf; ComponentLink2Description: Mouser; ComponentLink2URL: https://www.mouser.com.tr/ProductDetail/Samtec/FTSH-130-01-F-DV/?qs=0lQeLiL1qyaY5IDZ3XEJJA%3D%3D; Supplier 1: Mouser; Supplier Part Number 1: 200-FTSH13001FDV; Case: SMD
J3 = Connector - B100 Male Socket [B]: Headers & Wire Housings BREAKAWAY HDR VERT 6; Position: 60; Row: 2; Pitch: 1.27 mm; Mouser Part Number: 200-FTSH13001FDV; ROHS: Yes; ComponentLink1Description: DataSheet; ComponentLink1URL: https://www.mouser.com.tr/datasheet/2/527/ftsh_smt-1316912.pdf; ComponentLink2Description: Mouser; ComponentLink2URL: https://www.mouser.com.tr/ProductDetail/Samtec/FTSH-130-01-F-DV/?qs=0lQeLiL1qyaY5IDZ3XEJJA%3D%3D; Supplier 1: Mouser; Supplier Part Number 1: 200-FTSH13001FDV; Case: SMD

## Sheet Filter Capacitors - Port K.SchDoc: PORT K Filter Capacitors
size A4; ApprovedBy: Mehmet Günce Akkoyun; CheckedBy: Mehmet Günce Akkoyun; Author: Mehmet Günce Akkoyun; CompanyName: Ovoo Electronics; DrawnBy: Mehmet Günce Akkoyun; Engineer: Mehmet Günce Akkoyun; Organization: Ovoo Electronics; Address1: Necip Fazıl Mah. Ortaırmak Sok.; Address2: Birgül Apt. No: 19/6; Address3: Meram / Konya; Address4: Turkiye; DocumentNumber: 31; Revision: R06; SheetNumber: 31; SheetTotal: 54
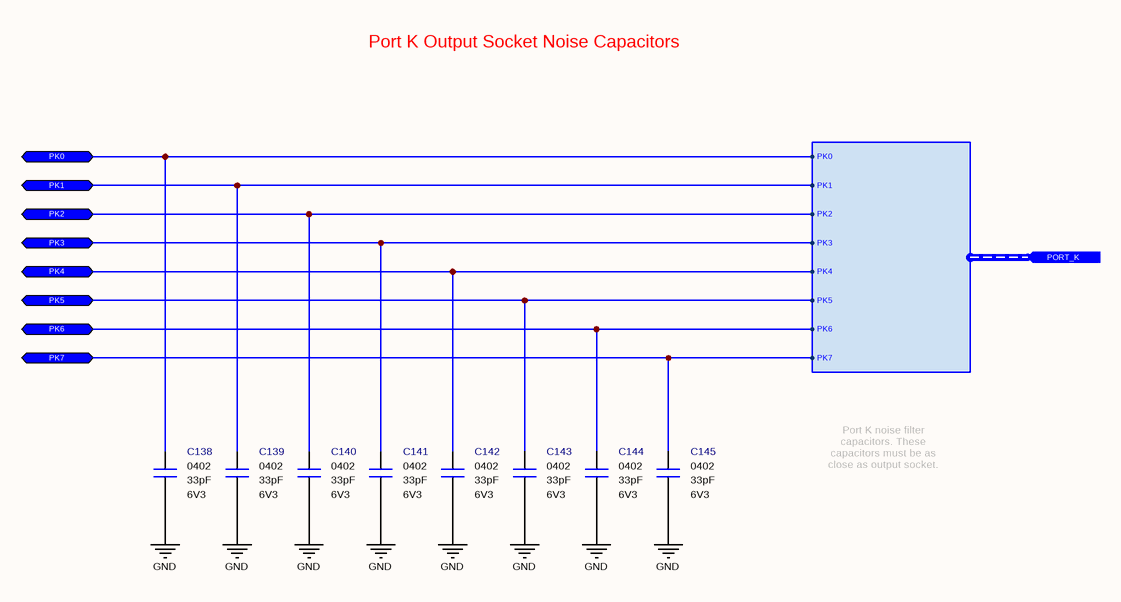
[diagram p37: Filter Capacitors - Port K.SchDoc]

### Parts
C138  value 33pF  Case: 0402  Voltage: 6V3  [CAPACITOR_0402]  (hidden comment: Multilayer Ceramic Capacitor)
C139  value 33pF  Case: 0402  Voltage: 6V3  [CAPACITOR_0402]  (hidden comment: Multilayer Ceramic Capacitor)
C140  value 33pF  Case: 0402  Voltage: 6V3  [CAPACITOR_0402]  (hidden comment: Multilayer Ceramic Capacitor)
C141  value 33pF  Case: 0402  Voltage: 6V3  [CAPACITOR_0402]  (hidden comment: Multilayer Ceramic Capacitor)
C142  value 33pF  Case: 0402  Voltage: 6V3  [CAPACITOR_0402]  (hidden comment: Multilayer Ceramic Capacitor)
C143  value 33pF  Case: 0402  Voltage: 6V3  [CAPACITOR_0402]  (hidden comment: Multilayer Ceramic Capacitor)
C144  value 33pF  Case: 0402  Voltage: 6V3  [CAPACITOR_0402]  (hidden comment: Multilayer Ceramic Capacitor)
C145  value 33pF  Case: 0402  Voltage: 6V3  [CAPACITOR_0402]  (hidden comment: Multilayer Ceramic Capacitor)

### Ports
PK0 (bidir), PK1 (bidir), PK2 (bidir), PK3 (bidir), PK4 (bidir), PK5 (bidir), PK6 (bidir), PK7 (bidir), PORT_K (in, harness PORT_K)

### Harnesses
PORT_K: PK0, PK1, PK2, PK3, PK4, PK5, PK7, PK6

### Nets
GND: C138.1 C139.1 C140.1 C141.1 C142.1 C143.1 C144.1 C145.1
PORT_K.PK0: C138.2 ; port PK0, port PORT_K.PK0
PORT_K.PK1: C139.2 ; port PK1, port PORT_K.PK1
PORT_K.PK2: C140.2 ; port PK2, port PORT_K.PK2
PORT_K.PK3: C141.2 ; port PK3, port PORT_K.PK3
PORT_K.PK4: C142.2 ; port PK4, port PORT_K.PK4
PORT_K.PK5: C143.2 ; port PK5, port PORT_K.PK5
PORT_K.PK6: C144.2 ; port PK6, port PORT_K.PK6
PORT_K.PK7: C145.2 ; port PK7, port PORT_K.PK7

### Notes on the sheet
- Port K Output Socket Noise Capacitors
- Port K noise filter capacitors. These capacitors must be as close as output socket.
- Title
- Size:
- Date:
- A4
- Number:
- Time:
- Revision:
- Sheet
- of
- File:

### Library data of the parts
C138-C145 = Capacitor - 33pF [0402-6V3]: as C102-C129 on sheet Module Output Sockets; Height: 0.5mm; Maximum Operating Temperature: +125; Minimum Operating Temperature: -55; ROHS: Yes; ComponentLink1Description: DataSheet; ComponentLink1URL: https://api.kemet.com/component-edge/download/datasheet/C0402C330J9RACAUTO.pdf; ComponentLink2Description: Mouser; ComponentLink2URL: https://www.mouser.com/Search/Refine.aspx?Keyword=80-C0402C330J9RAUTO; Supplier 1: Mouser; Supplier Part Number 1: 80-C0402C330J9RAUTO; Mouser Part Number: 80-C0402C330J9RAUTO

## Sheet Filter Capacitors - Master ICSP.SchDoc: Master ICSP Filter Capacitors
size A4; ApprovedBy: Mehmet Günce Akkoyun; CheckedBy: Mehmet Günce Akkoyun; Author: Mehmet Günce Akkoyun; CompanyName: Ovoo Electronics; DrawnBy: Mehmet Günce Akkoyun; Engineer: Mehmet Günce Akkoyun; Organization: Ovoo Electronics; Address1: Necip Fazıl Mah. Ortaırmak Sok.; Address2: Birgül Apt. No: 19/6; Address3: Meram / Konya; Address4: Turkiye; DocumentNumber: 33; Revision: R06; SheetNumber: 33; SheetTotal: 54
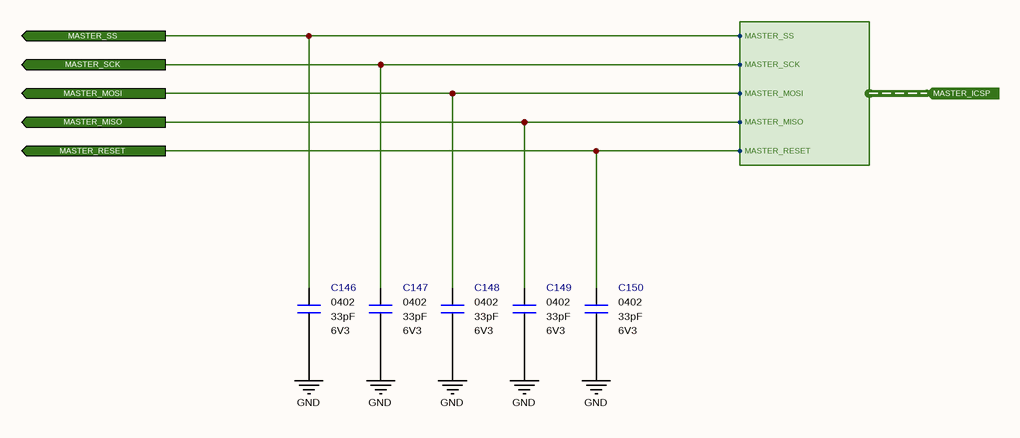
[diagram p38: Filter Capacitors - Master ICSP.SchDoc]

### Parts
C146  value 33pF  Case: 0402  Voltage: 6V3  [CAPACITOR_0402]  (hidden comment: Multilayer Ceramic Capacitor)
C147  value 33pF  Case: 0402  Voltage: 6V3  [CAPACITOR_0402]  (hidden comment: Multilayer Ceramic Capacitor)
C148  value 33pF  Case: 0402  Voltage: 6V3  [CAPACITOR_0402]  (hidden comment: Multilayer Ceramic Capacitor)
C149  value 33pF  Case: 0402  Voltage: 6V3  [CAPACITOR_0402]  (hidden comment: Multilayer Ceramic Capacitor)
C150  value 33pF  Case: 0402  Voltage: 6V3  [CAPACITOR_0402]  (hidden comment: Multilayer Ceramic Capacitor)

### Ports
MASTER_ICSP (in, harness MASTER_ICSP), MASTER_MISO (out), MASTER_MOSI (out), MASTER_RESET (out), MASTER_SCK (out), MASTER_SS (out)

### Harnesses
MASTER_ICSP: MASTER_RESET, MASTER_SCK, MASTER_MISO, MASTER_MOSI, MASTER_SS

### Nets
GND: C146.1 C147.1 C148.1 C149.1 C150.1
MASTER_ICSP.MASTER_MISO: C149.2 ; port MASTER_MISO, port MASTER_ICSP.MASTER_MISO
MASTER_ICSP.MASTER_MOSI: C148.2 ; port MASTER_MOSI, port MASTER_ICSP.MASTER_MOSI
MASTER_ICSP.MASTER_RESET: C150.2 ; port MASTER_RESET, port MASTER_ICSP.MASTER_RESET
MASTER_ICSP.MASTER_SCK: C147.2 ; port MASTER_SCK, port MASTER_ICSP.MASTER_SCK
MASTER_ICSP.MASTER_SS: C146.2 ; port MASTER_SS, port MASTER_ICSP.MASTER_SS

### Notes on the sheet
- Title
- Size:
- Date:
- A4
- Number:
- Time:
- Revision:
- Sheet
- of
- File:

### Library data of the parts
C146-C150 = Capacitor - 33pF [0402-6V3]: as C102-C129 on sheet Module Output Sockets; Height: 0.5mm; Maximum Operating Temperature: +125; Minimum Operating Temperature: -55; ROHS: Yes; ComponentLink1Description: DataSheet; ComponentLink1URL: https://api.kemet.com/component-edge/download/datasheet/C0402C330J9RACAUTO.pdf; ComponentLink2Description: Mouser; ComponentLink2URL: https://www.mouser.com/Search/Refine.aspx?Keyword=80-C0402C330J9RAUTO; Supplier 1: Mouser; Supplier Part Number 1: 80-C0402C330J9RAUTO; Mouser Part Number: 80-C0402C330J9RAUTO

## Sheet Filter Capacitors - Port C.SchDoc: PORT C Filter Capacitors
size A4; ApprovedBy: Mehmet Günce Akkoyun; CheckedBy: Mehmet Günce Akkoyun; Author: Mehmet Günce Akkoyun; CompanyName: Ovoo Electronics; DrawnBy: Mehmet Günce Akkoyun; Engineer: Mehmet Günce Akkoyun; Organization: Ovoo Electronics; Address1: Necip Fazıl Mah. Ortaırmak Sok.; Address2: Birgül Apt. No: 19/6; Address3: Meram / Konya; Address4: Turkiye; DocumentNumber: 30; Revision: R06; SheetNumber: 30; SheetTotal: 54
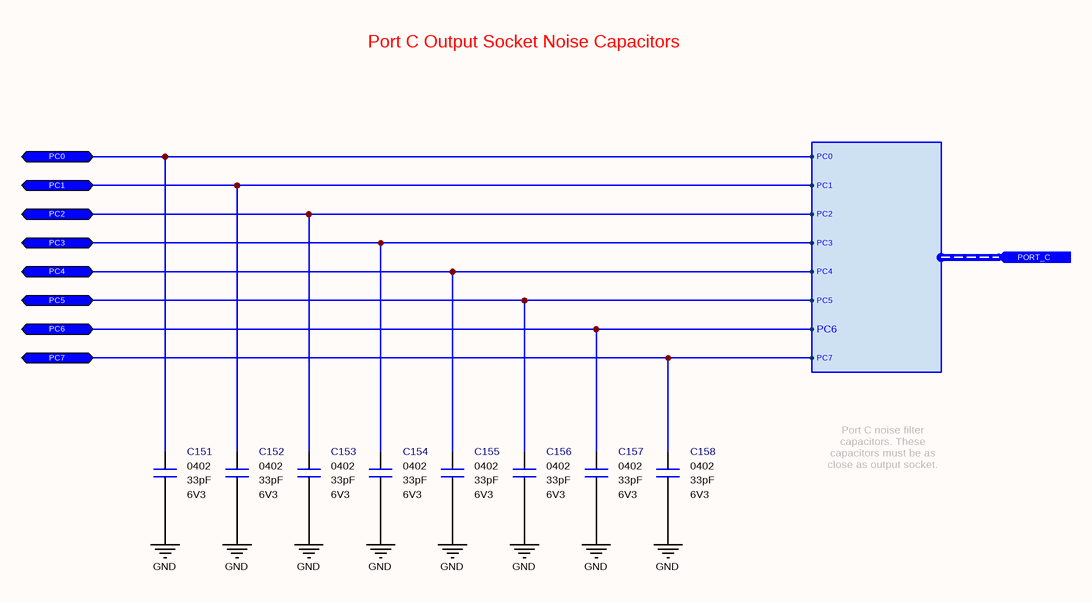
[diagram p39: Filter Capacitors - Port C.SchDoc]

### Parts
C151  value 33pF  Case: 0402  Voltage: 6V3  [CAPACITOR_0402]  (hidden comment: Multilayer Ceramic Capacitor)
C152  value 33pF  Case: 0402  Voltage: 6V3  [CAPACITOR_0402]  (hidden comment: Multilayer Ceramic Capacitor)
C153  value 33pF  Case: 0402  Voltage: 6V3  [CAPACITOR_0402]  (hidden comment: Multilayer Ceramic Capacitor)
C154  value 33pF  Case: 0402  Voltage: 6V3  [CAPACITOR_0402]  (hidden comment: Multilayer Ceramic Capacitor)
C155  value 33pF  Case: 0402  Voltage: 6V3  [CAPACITOR_0402]  (hidden comment: Multilayer Ceramic Capacitor)
C156  value 33pF  Case: 0402  Voltage: 6V3  [CAPACITOR_0402]  (hidden comment: Multilayer Ceramic Capacitor)
C157  value 33pF  Case: 0402  Voltage: 6V3  [CAPACITOR_0402]  (hidden comment: Multilayer Ceramic Capacitor)
C158  value 33pF  Case: 0402  Voltage: 6V3  [CAPACITOR_0402]  (hidden comment: Multilayer Ceramic Capacitor)

### Ports
PC0 (bidir), PC1 (bidir), PC2 (bidir), PC3 (bidir), PC4 (bidir), PC5 (bidir), PC6 (bidir), PC7 (bidir), PORT_C (in, harness PORT_C)

### Harnesses
PORT_C: PC0, PC1, PC2, PC3, PC4, PC5, PC7, PC6

### Nets
GND: C151.1 C152.1 C153.1 C154.1 C155.1 C156.1 C157.1 C158.1
PORT_C.PC0: C151.2 ; port PC0, port PORT_C.PC0
PORT_C.PC1: C152.2 ; port PC1, port PORT_C.PC1
PORT_C.PC2: C153.2 ; port PC2, port PORT_C.PC2
PORT_C.PC3: C154.2 ; port PC3, port PORT_C.PC3
PORT_C.PC4: C155.2 ; port PC4, port PORT_C.PC4
PORT_C.PC5: C156.2 ; port PC5, port PORT_C.PC5
PORT_C.PC6: C157.2 ; port PC6, port PORT_C.PC6
PORT_C.PC7: C158.2 ; port PC7, port PORT_C.PC7

### Notes on the sheet
- Port C Output Socket Noise Capacitors
- Port C noise filter capacitors. These capacitors must be as close as output socket.
- Title
- Size:
- Date:
- A4
- Number:
- Time:
- Revision:
- Sheet
- of
- File:

### Library data of the parts
C151-C158 = Capacitor - 33pF [0402-6V3]: as C102-C129 on sheet Module Output Sockets; Height: 0.5mm; Maximum Operating Temperature: +125; Minimum Operating Temperature: -55; ROHS: Yes; ComponentLink1Description: DataSheet; ComponentLink1URL: https://api.kemet.com/component-edge/download/datasheet/C0402C330J9RACAUTO.pdf; ComponentLink2Description: Mouser; ComponentLink2URL: https://www.mouser.com/Search/Refine.aspx?Keyword=80-C0402C330J9RAUTO; Supplier 1: Mouser; Supplier Part Number 1: 80-C0402C330J9RAUTO; Mouser Part Number: 80-C0402C330J9RAUTO

## Sheet Filter Capacitors - Port L.SchDoc: PORT L Filter Capacitors
size A4; ApprovedBy: Mehmet Günce Akkoyun; CheckedBy: Mehmet Günce Akkoyun; Author: Mehmet Günce Akkoyun; CompanyName: Ovoo Electronics; DrawnBy: Mehmet Günce Akkoyun; Engineer: Mehmet Günce Akkoyun; Organization: Ovoo Electronics; Address1: Necip Fazıl Mah. Ortaırmak Sok.; Address2: Birgül Apt. No: 19/6; Address3: Meram / Konya; Address4: Turkiye; DocumentNumber: 32; Revision: R06; SheetNumber: 32; SheetTotal: 54
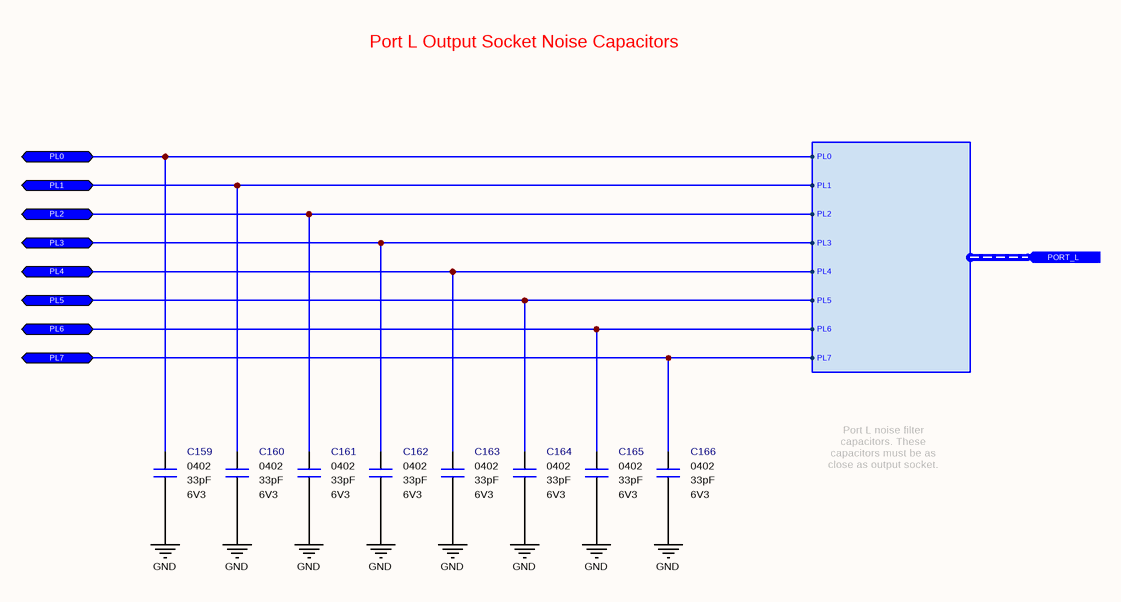
[diagram p40: Filter Capacitors - Port L.SchDoc]

### Parts
C159  value 33pF  Case: 0402  Voltage: 6V3  [CAPACITOR_0402]  (hidden comment: Multilayer Ceramic Capacitor)
C160  value 33pF  Case: 0402  Voltage: 6V3  [CAPACITOR_0402]  (hidden comment: Multilayer Ceramic Capacitor)
C161  value 33pF  Case: 0402  Voltage: 6V3  [CAPACITOR_0402]  (hidden comment: Multilayer Ceramic Capacitor)
C162  value 33pF  Case: 0402  Voltage: 6V3  [CAPACITOR_0402]  (hidden comment: Multilayer Ceramic Capacitor)
C163  value 33pF  Case: 0402  Voltage: 6V3  [CAPACITOR_0402]  (hidden comment: Multilayer Ceramic Capacitor)
C164  value 33pF  Case: 0402  Voltage: 6V3  [CAPACITOR_0402]  (hidden comment: Multilayer Ceramic Capacitor)
C165  value 33pF  Case: 0402  Voltage: 6V3  [CAPACITOR_0402]  (hidden comment: Multilayer Ceramic Capacitor)
C166  value 33pF  Case: 0402  Voltage: 6V3  [CAPACITOR_0402]  (hidden comment: Multilayer Ceramic Capacitor)

### Ports
PL0 (bidir), PL1 (bidir), PL2 (bidir), PL3 (bidir), PL4 (bidir), PL5 (bidir), PL6 (bidir), PL7 (bidir), PORT_L (in, harness PORT_L)

### Harnesses
PORT_L: PL0, PL1, PL2, PL3, PL4, PL5, PL7, PL6

### Nets
GND: C159.1 C160.1 C161.1 C162.1 C163.1 C164.1 C165.1 C166.1
PORT_L.PL0: C159.2 ; port PL0, port PORT_L.PL0
PORT_L.PL1: C160.2 ; port PL1, port PORT_L.PL1
PORT_L.PL2: C161.2 ; port PL2, port PORT_L.PL2
PORT_L.PL3: C162.2 ; port PL3, port PORT_L.PL3
PORT_L.PL4: C163.2 ; port PL4, port PORT_L.PL4
PORT_L.PL5: C164.2 ; port PL5, port PORT_L.PL5
PORT_L.PL6: C165.2 ; port PL6, port PORT_L.PL6
PORT_L.PL7: C166.2 ; port PL7, port PORT_L.PL7

### Notes on the sheet
- Port L Output Socket Noise Capacitors
- Port L noise filter capacitors. These capacitors must be as close as output socket.
- Engineer
- All Rights are reserved to Customer and Engineer. [2021]
- Size:
- Date:
- A4
- Project :
- Time:
- Sheet
- of
- Customer
- Product ID
- Module ID
- Version
- File:
- Revision

### Library data of the parts
C159-C166 = Capacitor - 33pF [0402-6V3]: as C102-C129 on sheet Module Output Sockets; Height: 0.5mm; Maximum Operating Temperature: +125; Minimum Operating Temperature: -55; ROHS: Yes; ComponentLink1Description: DataSheet; ComponentLink1URL: https://api.kemet.com/component-edge/download/datasheet/C0402C330J9RACAUTO.pdf; ComponentLink2Description: Mouser; ComponentLink2URL: https://www.mouser.com/Search/Refine.aspx?Keyword=80-C0402C330J9RAUTO; Supplier 1: Mouser; Supplier Part Number 1: 80-C0402C330J9RAUTO; Mouser Part Number: 80-C0402C330J9RAUTO

## Sheet Filter Capacitors - FOTA ICSP.SchDoc: FOTA ICSP Filter Capacitors
size A4; ApprovedBy: Mehmet Günce Akkoyun; CheckedBy: Mehmet Günce Akkoyun; Author: Mehmet Günce Akkoyun; CompanyName: Ovoo Electronics; DrawnBy: Mehmet Günce Akkoyun; Engineer: Mehmet Günce Akkoyun; Organization: Ovoo Electronics; Address1: Necip Fazıl Mah. Ortaırmak Sok.; Address2: Birgül Apt. No: 19/6; Address3: Meram / Konya; Address4: Turkiye; DocumentNumber: 34; Revision: R06; SheetNumber: 34; SheetTotal: 54
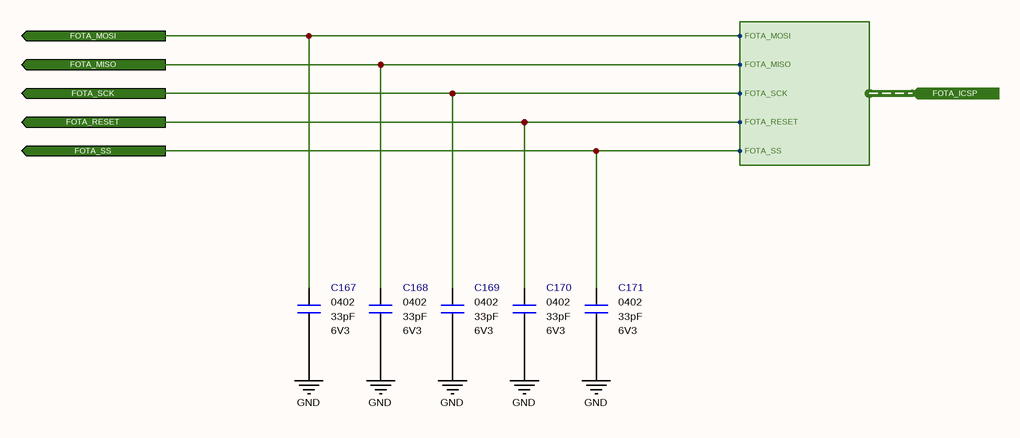
[diagram p41: Filter Capacitors - FOTA ICSP.SchDoc]

### Parts
C167  value 33pF  Case: 0402  Voltage: 6V3  [CAPACITOR_0402]  (hidden comment: Multilayer Ceramic Capacitor)
C168  value 33pF  Case: 0402  Voltage: 6V3  [CAPACITOR_0402]  (hidden comment: Multilayer Ceramic Capacitor)
C169  value 33pF  Case: 0402  Voltage: 6V3  [CAPACITOR_0402]  (hidden comment: Multilayer Ceramic Capacitor)
C170  value 33pF  Case: 0402  Voltage: 6V3  [CAPACITOR_0402]  (hidden comment: Multilayer Ceramic Capacitor)
C171  value 33pF  Case: 0402  Voltage: 6V3  [CAPACITOR_0402]  (hidden comment: Multilayer Ceramic Capacitor)

### Ports
FOTA_ICSP (in, harness FOTA_ICSP), FOTA_MISO (out), FOTA_MOSI (out), FOTA_RESET (out), FOTA_SCK (out), FOTA_SS (out)

### Harnesses
FOTA_ICSP: FOTA_RESET, FOTA_SCK, FOTA_MISO, FOTA_MOSI, FOTA_SS

### Nets
GND: C167.1 C168.1 C169.1 C170.1 C171.1
FOTA_ICSP.FOTA_MISO: C168.2 ; port FOTA_MISO, port FOTA_ICSP.FOTA_MISO
FOTA_ICSP.FOTA_MOSI: C167.2 ; port FOTA_MOSI, port FOTA_ICSP.FOTA_MOSI
FOTA_ICSP.FOTA_RESET: C170.2 ; port FOTA_RESET, port FOTA_ICSP.FOTA_RESET
FOTA_ICSP.FOTA_SCK: C169.2 ; port FOTA_SCK, port FOTA_ICSP.FOTA_SCK
FOTA_ICSP.FOTA_SS: C171.2 ; port FOTA_SS, port FOTA_ICSP.FOTA_SS

### Notes on the sheet
- Engineer
- All Rights are reserved to Customer and Engineer. [2021]
- Size:
- Date:
- A4
- Project :
- Time:
- Sheet
- of
- Customer
- Product ID
- Module ID
- Version
- File:
- Revision

### Library data of the parts
C167-C171 = Capacitor - 33pF [0402-6V3]: as C102-C129 on sheet Module Output Sockets; Height: 0.5mm; Maximum Operating Temperature: +125; Minimum Operating Temperature: -55; ROHS: Yes; ComponentLink1Description: DataSheet; ComponentLink1URL: https://api.kemet.com/component-edge/download/datasheet/C0402C330J9RACAUTO.pdf; ComponentLink2Description: Mouser; ComponentLink2URL: https://www.mouser.com/Search/Refine.aspx?Keyword=80-C0402C330J9RAUTO; Supplier 1: Mouser; Supplier Part Number 1: 80-C0402C330J9RAUTO; Mouser Part Number: 80-C0402C330J9RAUTO

## Sheet Filter Capacitors - External SIM.SchDoc: External SIM Filter Capacitors
size A4; ApprovedBy: Mehmet Günce Akkoyun; CheckedBy: Mehmet Günce Akkoyun; Author: Mehmet Günce Akkoyun; CompanyName: Ovoo Electronics; DrawnBy: Mehmet Günce Akkoyun; Engineer: Mehmet Günce Akkoyun; Organization: Ovoo Electronics; Address1: Necip Fazıl Mah. Ortaırmak Sok.; Address2: Birgül Apt. No: 19/6; Address3: Meram / Konya; Address4: Turkiye; DocumentNumber: 35; Revision: R06; SheetNumber: 35; SheetTotal: 54
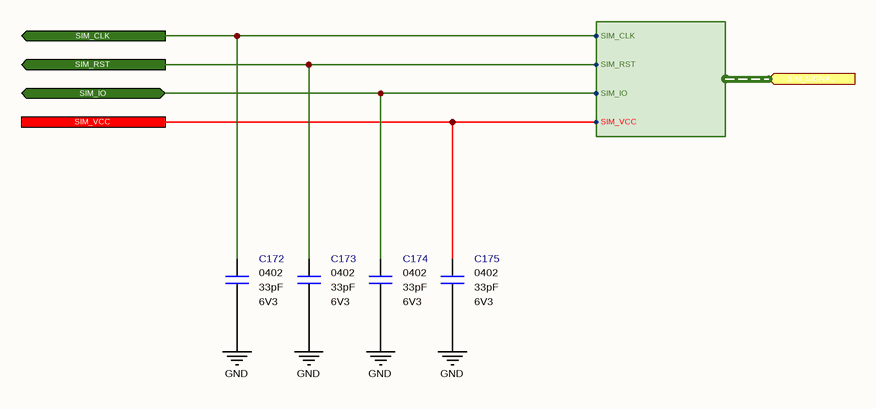
[diagram p42: Filter Capacitors - External SIM.SchDoc]

### Parts
C172  value 33pF  Case: 0402  Voltage: 6V3  [CAPACITOR_0402]  (hidden comment: Multilayer Ceramic Capacitor)
C173  value 33pF  Case: 0402  Voltage: 6V3  [CAPACITOR_0402]  (hidden comment: Multilayer Ceramic Capacitor)
C174  value 33pF  Case: 0402  Voltage: 6V3  [CAPACITOR_0402]  (hidden comment: Multilayer Ceramic Capacitor)
C175  value 33pF  Case: 0402  Voltage: 6V3  [CAPACITOR_0402]  (hidden comment: Multilayer Ceramic Capacitor)

### Ports
SIM_CLK (out), SIM_IO (bidir), SIM_RST (out), SIM_SIGNAL (in, harness SIM_SIGNAL), SIM_VCC

### Harnesses
SIM_SIGNAL: SIM_VCC, SIM_IO, SIM_RST, SIM_CLK

### Nets
GND: C172.1 C173.1 C174.1 C175.1
SIM_CLK: C172.2 ; port SIM_CLK, port SIM_SIGNAL.SIM_CLK
SIM_IO: C174.2 ; port SIM_IO, port SIM_SIGNAL.SIM_IO
SIM_RST: C173.2 ; port SIM_RST, port SIM_SIGNAL.SIM_RST
SIM_VCC: C175.2 ; port SIM_VCC, port SIM_SIGNAL.SIM_VCC

### Notes on the sheet
- Engineer
- All Rights are reserved to Customer and Engineer. [2021]
- Size:
- Date:
- A4
- Project :
- Time:
- Sheet
- of
- Customer
- Product ID
- Module ID
- Version
- File:
- Revision

### Library data of the parts
C172-C175 = Capacitor - 33pF [0402-6V3]: as C102-C129 on sheet Module Output Sockets; Height: 0.5mm; Maximum Operating Temperature: +125; Minimum Operating Temperature: -55; ROHS: Yes; ComponentLink1Description: DataSheet; ComponentLink1URL: https://api.kemet.com/component-edge/download/datasheet/C0402C330J9RACAUTO.pdf; ComponentLink2Description: Mouser; ComponentLink2URL: https://www.mouser.com/Search/Refine.aspx?Keyword=80-C0402C330J9RAUTO; Supplier 1: Mouser; Supplier Part Number 1: 80-C0402C330J9RAUTO; Mouser Part Number: 80-C0402C330J9RAUTO

## Sheet Filter Capacitors - Signal IoT.SchDoc: Signal IoT Filter Capacitors
size A4; ApprovedBy: Mehmet Günce Akkoyun; CheckedBy: Mehmet Günce Akkoyun; Author: Mehmet Günce Akkoyun; CompanyName: Ovoo Electronics; DrawnBy: Mehmet Günce Akkoyun; Engineer: Mehmet Günce Akkoyun; Organization: Ovoo Electronics; Address1: Necip Fazıl Mah. Ortaırmak Sok.; Address2: Birgül Apt. No: 19/6; Address3: Meram / Konya; Address4: Turkiye; DocumentNumber: 36; Revision: R06; SheetNumber: 36; SheetTotal: 54
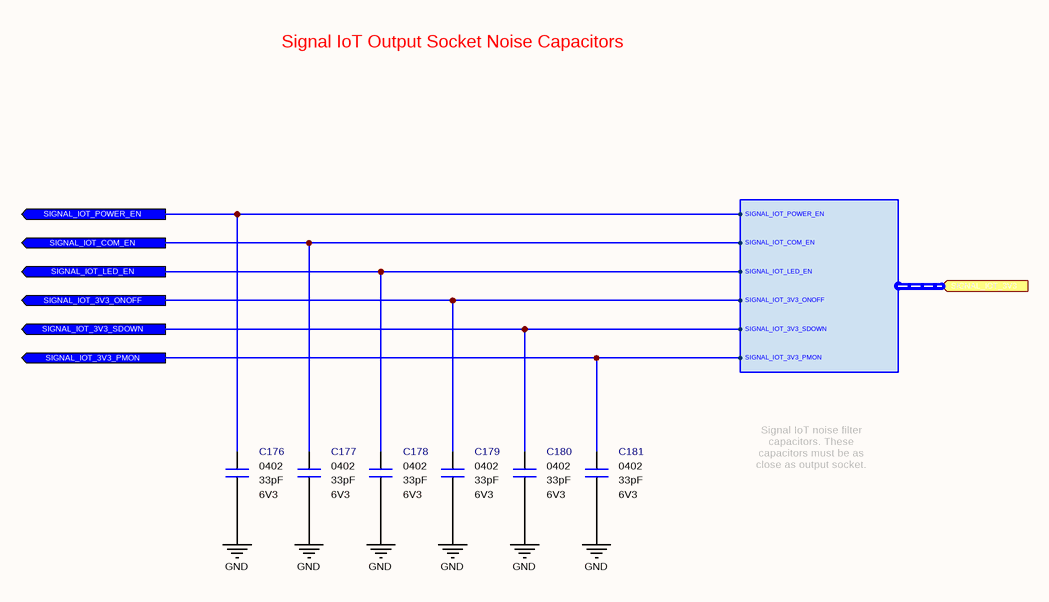
[diagram p43: Filter Capacitors - Signal IoT.SchDoc]

### Parts
C176  value 33pF  Case: 0402  Voltage: 6V3  [CAPACITOR_0402]  (hidden comment: Multilayer Ceramic Capacitor)
C177  value 33pF  Case: 0402  Voltage: 6V3  [CAPACITOR_0402]  (hidden comment: Multilayer Ceramic Capacitor)
C178  value 33pF  Case: 0402  Voltage: 6V3  [CAPACITOR_0402]  (hidden comment: Multilayer Ceramic Capacitor)
C179  value 33pF  Case: 0402  Voltage: 6V3  [CAPACITOR_0402]  (hidden comment: Multilayer Ceramic Capacitor)
C180  value 33pF  Case: 0402  Voltage: 6V3  [CAPACITOR_0402]  (hidden comment: Multilayer Ceramic Capacitor)
C181  value 33pF  Case: 0402  Voltage: 6V3  [CAPACITOR_0402]  (hidden comment: Multilayer Ceramic Capacitor)

### Ports
SIGNAL_IOT_3V3 (in, harness SIGNAL_IOT_3V3), SIGNAL_IOT_3V3_ONOFF (out), SIGNAL_IOT_3V3_PMON (out), SIGNAL_IOT_3V3_SDOWN (out), SIGNAL_IOT_COM_EN (out), SIGNAL_IOT_LED_EN (out), SIGNAL_IOT_POWER_EN (out)

### Harnesses
SIGNAL_IOT_3V3: SIGNAL_IOT_COM_EN, SIGNAL_IOT_POWER_EN, SIGNAL_IOT_LED_EN, SIGNAL_IOT_3V3_SDOWN, SIGNAL_IOT_3V3_ONOFF, SIGNAL_IOT_3V3_PMON

### Nets
GND: C176.1 C177.1 C178.1 C179.1 C180.1 C181.1
SIGNAL_IOT_3V3.SIGNAL_IOT_3V3_ONOFF: C179.2 ; port SIGNAL_IOT_3V3_ONOFF, port SIGNAL_IOT_3V3.SIGNAL_IOT_3V3_ONOFF
SIGNAL_IOT_3V3.SIGNAL_IOT_3V3_PMON: C181.2 ; port SIGNAL_IOT_3V3_PMON, port SIGNAL_IOT_3V3.SIGNAL_IOT_3V3_PMON
SIGNAL_IOT_3V3.SIGNAL_IOT_3V3_SDOWN: C180.2 ; port SIGNAL_IOT_3V3_SDOWN, port SIGNAL_IOT_3V3.SIGNAL_IOT_3V3_SDOWN
SIGNAL_IOT_3V3.SIGNAL_IOT_COM_EN: C177.2 ; port SIGNAL_IOT_COM_EN, port SIGNAL_IOT_3V3.SIGNAL_IOT_COM_EN
SIGNAL_IOT_3V3.SIGNAL_IOT_LED_EN: C178.2 ; port SIGNAL_IOT_LED_EN, port SIGNAL_IOT_3V3.SIGNAL_IOT_LED_EN
SIGNAL_IOT_3V3.SIGNAL_IOT_POWER_EN: C176.2 ; port SIGNAL_IOT_POWER_EN, port SIGNAL_IOT_3V3.SIGNAL_IOT_POWER_EN

### Notes on the sheet
- Signal IoT Output Socket Noise Capacitors
- Signal IoT noise filter capacitors. These capacitors must be as close as output socket.
- Title
- Size:
- Date:
- A4
- Number:
- Time:
- Revision:
- Sheet
- of
- File:

### Library data of the parts
C176-C181 = Capacitor - 33pF [0402-6V3]: as C102-C129 on sheet Module Output Sockets; Height: 0.5mm; Maximum Operating Temperature: +125; Minimum Operating Temperature: -55; ROHS: Yes; ComponentLink1Description: DataSheet; ComponentLink1URL: https://api.kemet.com/component-edge/download/datasheet/C0402C330J9RACAUTO.pdf; ComponentLink2Description: Mouser; ComponentLink2URL: https://www.mouser.com/Search/Refine.aspx?Keyword=80-C0402C330J9RAUTO; Supplier 1: Mouser; Supplier Part Number 1: 80-C0402C330J9RAUTO; Mouser Part Number: 80-C0402C330J9RAUTO

## Sheet Filter Capacitors - Port A.SchDoc: PORT A Filter Capacitors
size A4; ApprovedBy: Mehmet Günce Akkoyun; CheckedBy: Mehmet Günce Akkoyun; Author: Mehmet Günce Akkoyun; CompanyName: Ovoo Electronics; DrawnBy: Mehmet Günce Akkoyun; Engineer: Mehmet Günce Akkoyun; Organization: Ovoo Electronics; Address1: Necip Fazıl Mah. Ortaırmak Sok.; Address2: Birgül Apt. No: 19/6; Address3: Meram / Konya; Address4: Turkiye; DocumentNumber: 37; Revision: R06; SheetNumber: 37; SheetTotal: 54
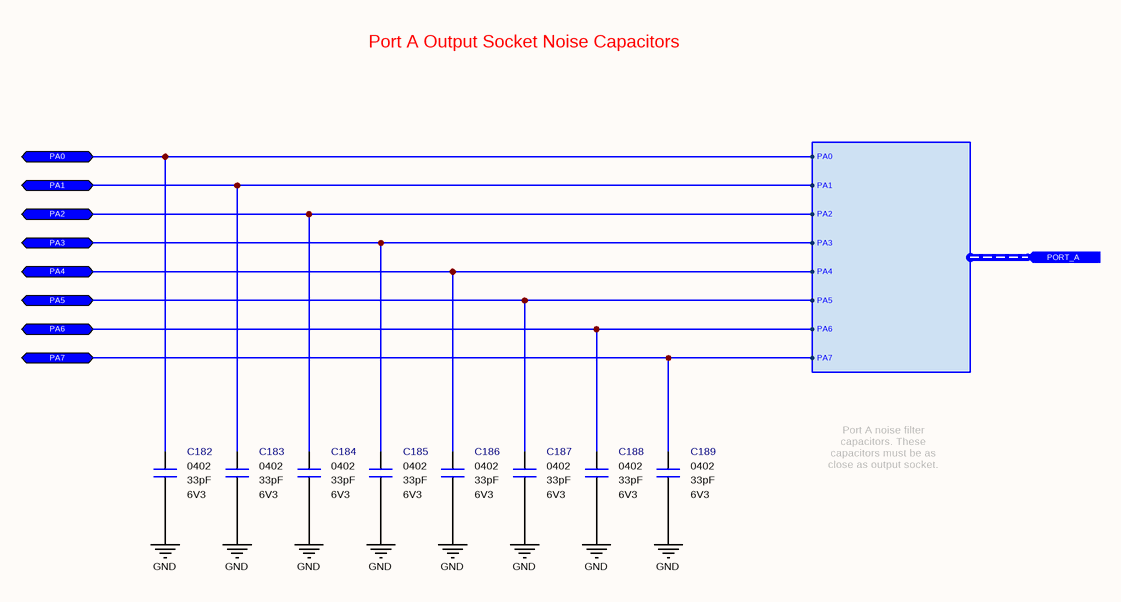
[diagram p44: Filter Capacitors - Port A.SchDoc]

### Parts
C182  value 33pF  Case: 0402  Voltage: 6V3  [CAPACITOR_0402]  (hidden comment: Multilayer Ceramic Capacitor)
C183  value 33pF  Case: 0402  Voltage: 6V3  [CAPACITOR_0402]  (hidden comment: Multilayer Ceramic Capacitor)
C184  value 33pF  Case: 0402  Voltage: 6V3  [CAPACITOR_0402]  (hidden comment: Multilayer Ceramic Capacitor)
C185  value 33pF  Case: 0402  Voltage: 6V3  [CAPACITOR_0402]  (hidden comment: Multilayer Ceramic Capacitor)
C186  value 33pF  Case: 0402  Voltage: 6V3  [CAPACITOR_0402]  (hidden comment: Multilayer Ceramic Capacitor)
C187  value 33pF  Case: 0402  Voltage: 6V3  [CAPACITOR_0402]  (hidden comment: Multilayer Ceramic Capacitor)
C188  value 33pF  Case: 0402  Voltage: 6V3  [CAPACITOR_0402]  (hidden comment: Multilayer Ceramic Capacitor)
C189  value 33pF  Case: 0402  Voltage: 6V3  [CAPACITOR_0402]  (hidden comment: Multilayer Ceramic Capacitor)

### Ports
PA0 (bidir), PA1 (bidir), PA2 (bidir), PA3 (bidir), PA4 (bidir), PA5 (bidir), PA6 (bidir), PA7 (bidir), PORT_A (in, harness PORT_A)

### Harnesses
PORT_A: PA0, PA1, PA2, PA3, PA4, PA5, PA7, PA6

### Nets
GND: C182.1 C183.1 C184.1 C185.1 C186.1 C187.1 C188.1 C189.1
PORT_A.PA0: C182.2 ; port PA0, port PORT_A.PA0
PORT_A.PA1: C183.2 ; port PA1, port PORT_A.PA1
PORT_A.PA2: C184.2 ; port PA2, port PORT_A.PA2
PORT_A.PA3: C185.2 ; port PA3, port PORT_A.PA3
PORT_A.PA4: C186.2 ; port PA4, port PORT_A.PA4
PORT_A.PA5: C187.2 ; port PA5, port PORT_A.PA5
PORT_A.PA6: C188.2 ; port PA6, port PORT_A.PA6
PORT_A.PA7: C189.2 ; port PA7, port PORT_A.PA7

### Notes on the sheet
- Port A Output Socket Noise Capacitors
- Port A noise filter capacitors. These capacitors must be as close as output socket.
- Engineer
- All Rights are reserved to Customer and Engineer. [2021]
- Size:
- Date:
- A4
- Project :
- Time:
- Sheet
- of
- Customer
- Product ID
- Module ID
- Version
- File:
- Revision

### Library data of the parts
C182-C189 = Capacitor - 33pF [0402-6V3]: as C102-C129 on sheet Module Output Sockets; Height: 0.5mm; Maximum Operating Temperature: +125; Minimum Operating Temperature: -55; ROHS: Yes; ComponentLink1Description: DataSheet; ComponentLink1URL: https://api.kemet.com/component-edge/download/datasheet/C0402C330J9RACAUTO.pdf; ComponentLink2Description: Mouser; ComponentLink2URL: https://www.mouser.com/Search/Refine.aspx?Keyword=80-C0402C330J9RAUTO; Supplier 1: Mouser; Supplier Part Number 1: 80-C0402C330J9RAUTO; Mouser Part Number: 80-C0402C330J9RAUTO

## Sheet Filter Capacitors - FOTA Digital ICSP.SchDoc: FOTA Digital ICSP Filter Capacitors
size A4; ApprovedBy: Mehmet Günce Akkoyun; CheckedBy: Mehmet Günce Akkoyun; Author: Mehmet Günce Akkoyun; CompanyName: Ovoo Electronics; DrawnBy: Mehmet Günce Akkoyun; Engineer: Mehmet Günce Akkoyun; Organization: Ovoo Electronics; Address1: Necip Fazıl Mah. Ortaırmak Sok.; Address2: Birgül Apt. No: 19/6; Address3: Meram / Konya; Address4: Turkiye; DocumentNumber: 38; Revision: R06; SheetNumber: 38; SheetTotal: 54
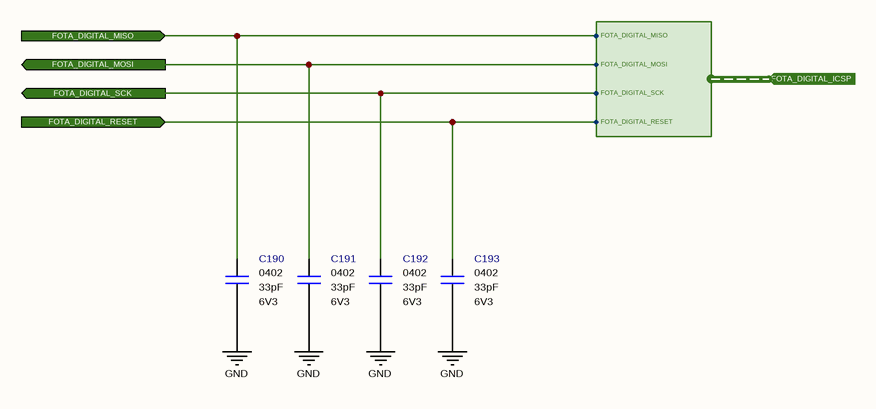
[diagram p45: Filter Capacitors - FOTA Digital ICSP.SchDoc]

### Parts
C190  value 33pF  Case: 0402  Voltage: 6V3  [CAPACITOR_0402]  (hidden comment: Multilayer Ceramic Capacitor)
C191  value 33pF  Case: 0402  Voltage: 6V3  [CAPACITOR_0402]  (hidden comment: Multilayer Ceramic Capacitor)
C192  value 33pF  Case: 0402  Voltage: 6V3  [CAPACITOR_0402]  (hidden comment: Multilayer Ceramic Capacitor)
C193  value 33pF  Case: 0402  Voltage: 6V3  [CAPACITOR_0402]  (hidden comment: Multilayer Ceramic Capacitor)

### Ports
FOTA_DIGITAL_ICSP (in, harness FOTA_DIGITAL_ICSP), FOTA_DIGITAL_MISO (in), FOTA_DIGITAL_MOSI (out), FOTA_DIGITAL_RESET (in), FOTA_DIGITAL_SCK (out)

### Harnesses
FOTA_DIGITAL_ICSP: FOTA_DIGITAL_SCK, FOTA_DIGITAL_MOSI, FOTA_DIGITAL_MISO, FOTA_DIGITAL_RESET

### Nets
GND: C190.1 C191.1 C192.1 C193.1
FOTA_DIGITAL_ICSP.FOTA_DIGITAL_MISO: C190.2 ; port FOTA_DIGITAL_MISO, port FOTA_DIGITAL_ICSP.FOTA_DIGITAL_MISO
FOTA_DIGITAL_ICSP.FOTA_DIGITAL_MOSI: C191.2 ; port FOTA_DIGITAL_MOSI, port FOTA_DIGITAL_ICSP.FOTA_DIGITAL_MOSI
FOTA_DIGITAL_ICSP.FOTA_DIGITAL_RESET: C193.2 ; port FOTA_DIGITAL_RESET, port FOTA_DIGITAL_ICSP.FOTA_DIGITAL_RESET
FOTA_DIGITAL_ICSP.FOTA_DIGITAL_SCK: C192.2 ; port FOTA_DIGITAL_SCK, port FOTA_DIGITAL_ICSP.FOTA_DIGITAL_SCK

### Notes on the sheet
- Title
- Size:
- Date:
- A4
- Number:
- Time:
- Revision:
- Sheet
- of
- File:

### Library data of the parts
C190-C193 = Capacitor - 33pF [0402-6V3]: as C102-C129 on sheet Module Output Sockets; Height: 0.5mm; Maximum Operating Temperature: +125; Minimum Operating Temperature: -55; ROHS: Yes; ComponentLink1Description: DataSheet; ComponentLink1URL: https://api.kemet.com/component-edge/download/datasheet/C0402C330J9RACAUTO.pdf; ComponentLink2Description: Mouser; ComponentLink2URL: https://www.mouser.com/Search/Refine.aspx?Keyword=80-C0402C330J9RAUTO; Supplier 1: Mouser; Supplier Part Number 1: 80-C0402C330J9RAUTO; Mouser Part Number: 80-C0402C330J9RAUTO